# EAGLE board All-in-one Starter Kit for ESP32 P4_V1.0 (EAGLE 9.6.2), part 1 of 3
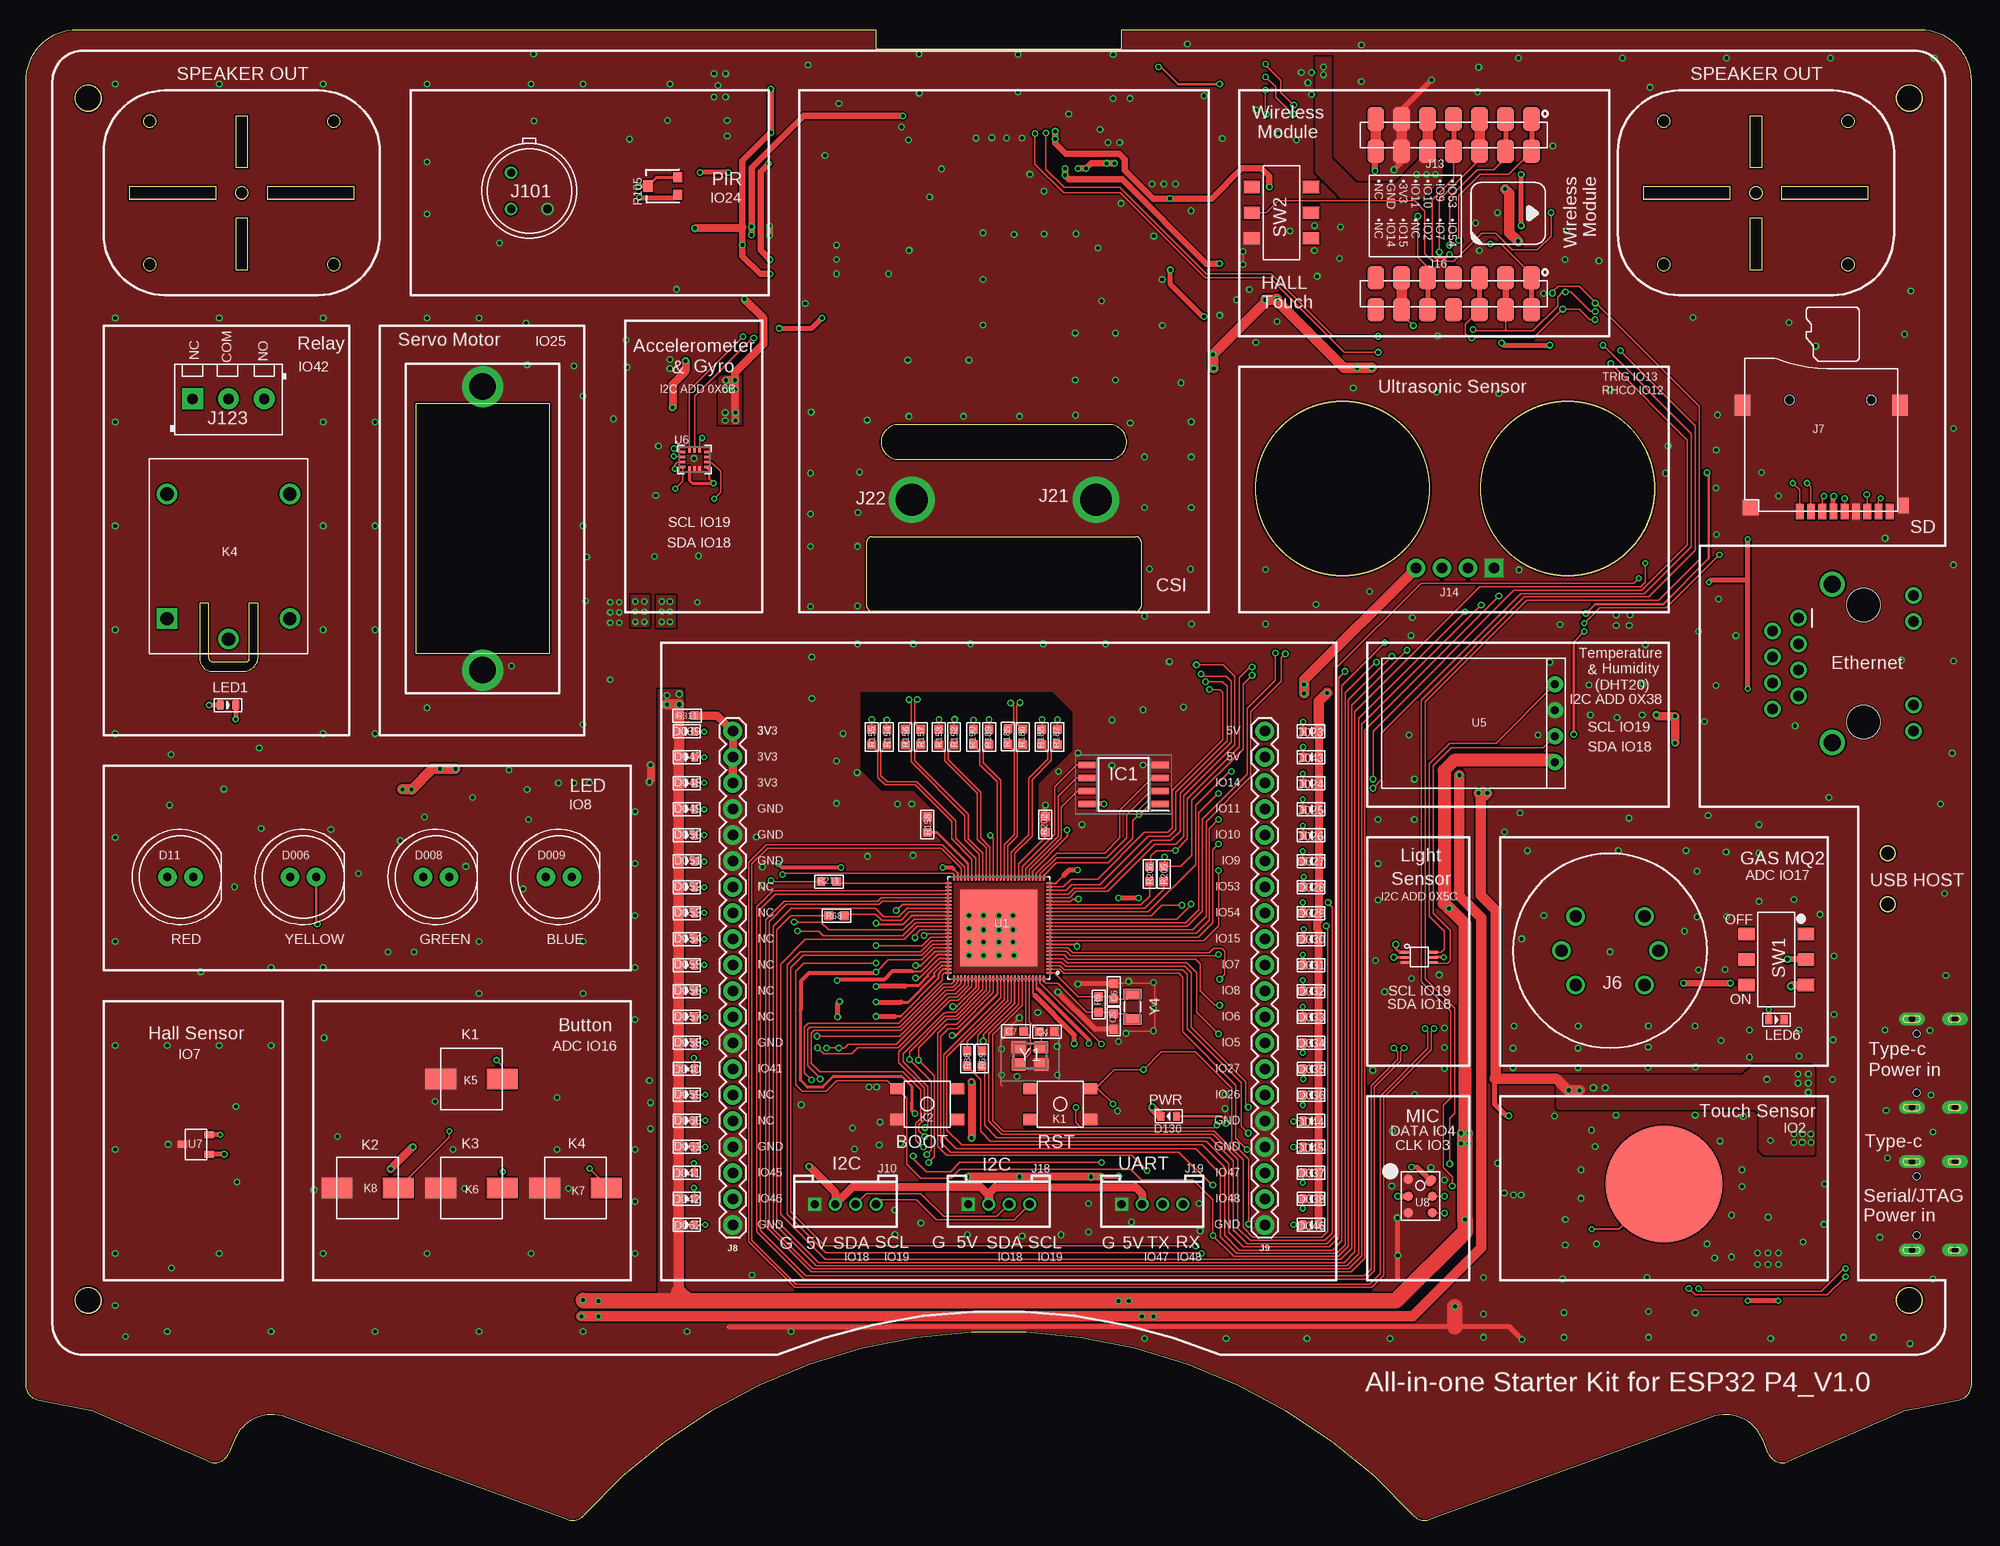
[diagram p9: board, top side]
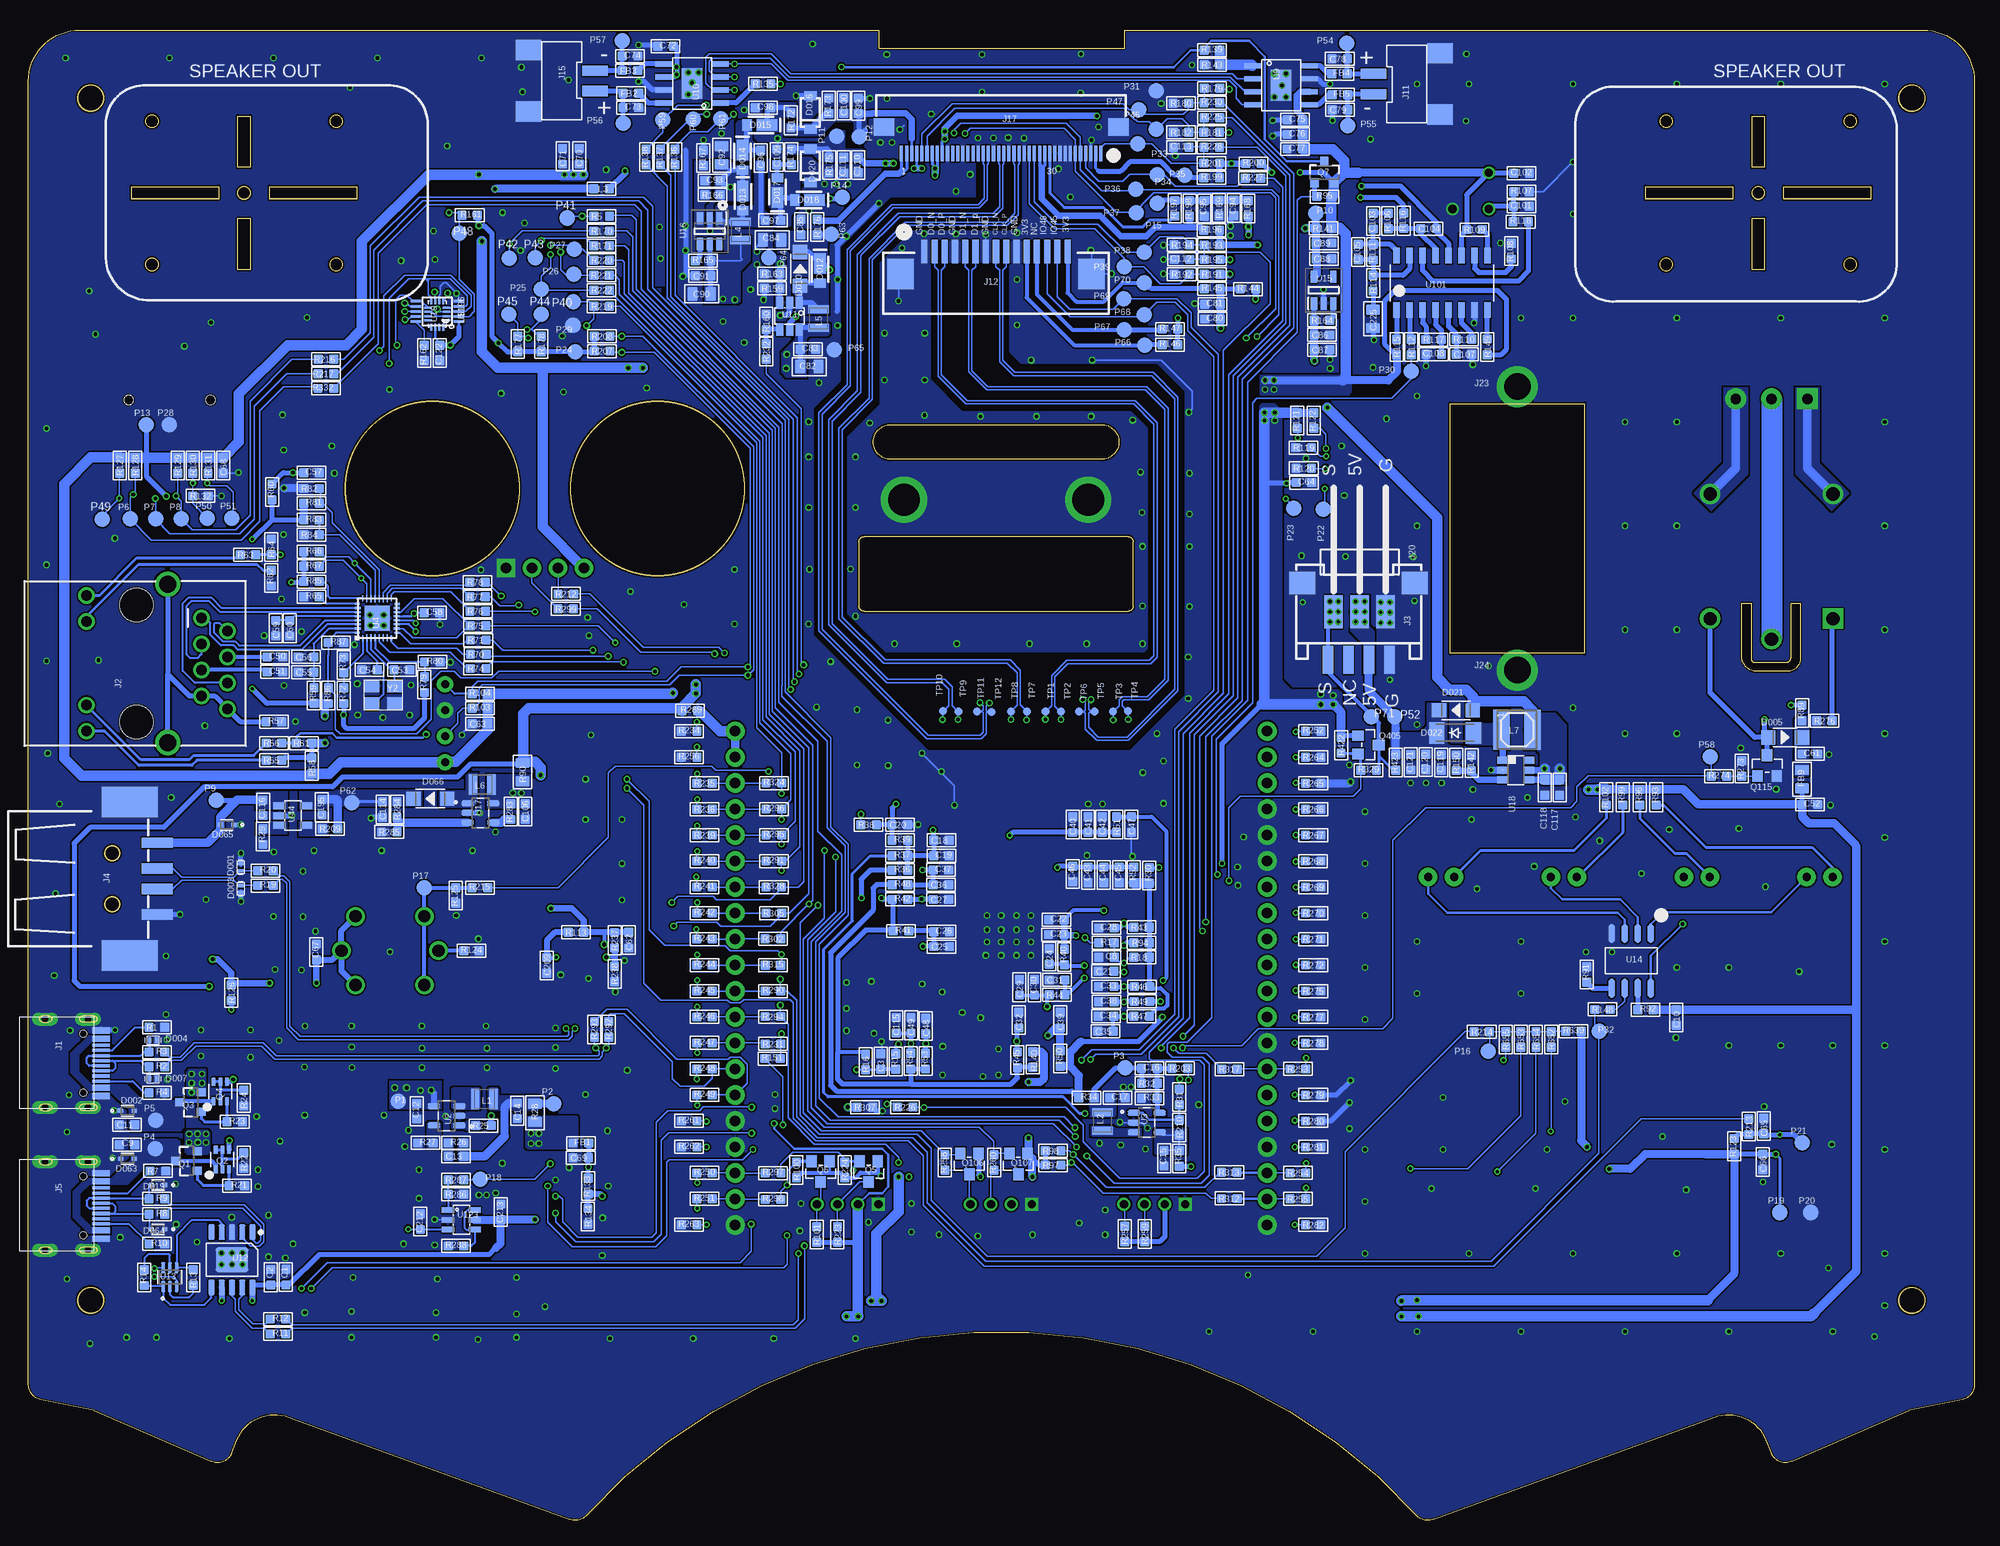
[diagram p10: board, bottom side, seen from below]

Size 190.2 x 145.66 mm. Coordinates in mm from the lower left corner, seen from the top.
Outline: 10.13,130.36 10.13,129.16 18.63,129.16 18.63,130.36 10.13,130.36
Outline: 20.53,137.26 20.53,132.26 21.73,132.26 21.73,137.26 20.53,137.26
Outline: 20.53,127.26 20.53,122.26 21.73,122.26 21.73,127.26 20.53,127.26
Outline: 23.63,130.36 23.63,129.16 32.13,129.16 32.13,130.36 23.63,130.36
Outline: 38.13,109.15 38.13,84.75 51.23,84.75 51.23,109.15 38.13,109.15
Outline: 158.13,130.36 158.13,129.16 166.63,129.16 166.63,130.36 158.13,130.36
Outline: 168.53,122.26 169.73,122.26 169.73,127.26 168.53,127.26 168.53,122.26
Outline: 168.53,137.26 168.53,132.26 169.73,132.26 169.73,137.26 168.53,137.26
Outline: 171.63,129.16 180.13,129.16 180.13,130.36 171.63,130.36 171.63,129.16
Outline: 17.04,89.63 17.04,84.39 arc90 18.11,82.99 21.41,82.99 arc90 22.75,84.67 22.75,89.64 21.82,89.64 21.82,84.36 arc-90 21.51,83.85 18.41,83.85 arc-90 17.93,84.33 17.93,89.63 17.04,89.63
Outline: 180.13,129.15 180.13,130.35 171.63,130.35 171.63,129.15 180.13,129.15
Outline: 169.73,122.25 169.73,127.25 168.53,127.25 168.53,122.25 169.73,122.25
Outline: 169.73,132.25 169.73,137.25 168.53,137.25 168.53,132.25 169.73,132.25
Outline: 166.63,129.15 166.63,130.35 158.13,130.35 158.13,129.15 166.63,129.15
Outline: 108.53,88.85 82.73,88.85 arc-90 82.23,89.35 82.23,95.65 arc-90 82.73,96.15 108.53,96.15 arc-90 109.03,95.65 109.03,89.35 arc-90 108.53,88.85
Outline: 20.53,122.25 21.73,122.25 21.73,127.25 20.53,127.25 20.53,122.25
Outline: 23.63,129.15 32.13,129.15 32.13,130.35 23.63,130.35 23.63,129.15
Outline: 10.13,129.15 18.63,129.15 18.63,130.35 10.13,130.35 10.13,129.15
Outline: 20.53,132.25 21.73,132.25 21.73,137.25 20.53,137.25 20.53,132.25
Outline: 85.33,103.7 105.93,103.7 arc180 105.93,107.1 85.33,107.1 arc180 85.33,103.7
Outline: 17.87,5.76 6.37,10.77 arc-1 1.2,11.79 arc-78 0,13.26 0,140.66 arc-90 5,145.66 83.1,145.66 83.1,143.86 107.1,143.86 107.1,145.66 185.2,145.66 arc-90 190.2,140.66 190.2,13.26 arc-78 189,11.79 arc-1 183.83,10.77 172.33,5.76 arc-92 170.34,6.57 169.83,7.84 arc88 164.75,10.1 137.28,0.09 arc-68 135.66,0.49 arc96 54.54,0.49 arc-68 52.92,0.09 25.45,10.1 arc88 20.37,7.84 19.86,6.57 arc-92 17.87,5.76
Outline: circle at 12.13,122.76 radius 0.6
Outline: circle at 12.13,136.76 radius 0.6
Outline: circle at 21.13,129.76 radius 0.6
Outline: circle at 30.13,122.76 radius 0.6
Outline: circle at 30.13,136.76 radius 0.6
Outline: circle at 128.72,100.86 radius 8.5
Outline: circle at 150.73,100.86 radius 8.5
Outline: circle at 160.13,122.76 radius 0.6
Outline: circle at 169.13,129.76 radius 0.6
Outline: circle at 160.13,136.76 radius 0.6
Outline: circle at 178.13,122.76 radius 0.6
Outline: circle at 178.13,136.76 radius 0.6
Outline: circle at 6.13,21.51 radius 1.25
Outline: circle at 6.13,139.01 radius 1.25
Outline: circle at 184.13,21.51 radius 1.25
Outline: circle at 184.13,139.01 radius 1.25
Outline: circle at 182.01,65.22 radius 0.7
Outline: circle at 182.01,60.22 radius 0.7
Outline: circle at 150.73,100.85 radius 8.5
Outline: circle at 128.72,100.85 radius 8.5
Copper layers (1*16): Top 0.035mm / dielectric 1.5mm / Bottom 0.035mm
Design rules "HMI_GZ *": minimum track width 6mil, minimum drill 0.3mm, track to track 6mil, track to pad 6mil, pad to pad 6mil, via to via 6mil, smd to smd 0mil, copper to edge 6mil, drill to drill 4mil, minimum pad ring 6mil, minimum via ring 6mil, stop-mask expansion 4mil, vias tented up to drill 100mil, thermal gap 0mil
Net classes: 1 power: width 1 mm, drill 0.3 mm, clearance 0.152 mm

## Footprints (pad centres in the part's own frame; a part is rotated, then mirrored left to right if it is on the bottom)
0603 = smd 0.889 x 0.889: 1 -0.762,0; 2 0.762,0
C0603 = smd 0.889 x 0.889: 1 -0.762,0; 2 0.762,0
C0805 = smd 1.016 x 1.397: 1 -0.889,0; 2 0.889,0
H5VL10B = smd 0.3 x 0.6: 1 -0.325,0; 2 0.325,0
TVS_LESD5D5.0CT1G = smd 0.48 x 0.4: 1 -0.66,0; 2 0.66,0
D_SOD123 = smd 1.397 x 1.397: + -1.651,0; - 1.651,0
LED-8MM = drill 0.8 pad 1.8: 1 -1.27,0; 2 1.27,0
D_SOD123FL = smd 1.397 x 1.397: + -1.651,0; - 1.651,0
LMBR140ET1G = smd 2 x 1.1: 1 -0.975,0 | smd 0.9 x 1.1: 2 0.975,0
LMSZ5233BT1G = smd 0.91 x 1.22: 1 -1.635,0; 2 1.635,0
SOD-123_MINI-SMA = smd 1.5 x 2.1: A 1.8,0; C -1.8,0
LED_0603_SMT = smd 0.762 x 0.889: 1 -0.762,0; 2 0.762,0
L0603 = smd 0.889 x 0.889: 1 -0.762,0; 2 0.762,0
L0805 = smd 1.016 x 1.397: 1 -0.889,0; 2 0.889,0
SOIC127P790X216-8N = smd 1.65 x 0.65: 1 -3.6,1.905; 2 -3.6,0.635; 3 -3.6,-0.635; 4 -3.6,-1.905; 5 3.6,-1.905; 6 3.6,-0.635; 7 3.6,0.635; 8 3.6,1.905
WZ3532R024-ESP32-V0.1-20221226_KEVIN_3.0TYPEC-SMD = smd 0.3 x 1.7: A1 -3.35,0.5; A4 -2.55,0.5; A5 -1.25,0.5; A6 -0.25,0.5; A7 0.25,0.5; A8 1.25,0.5; A9 2.55,0.5; A12 3.35,0.5; B1 3.05,0.5; B4 2.25,0.5; B5 1.75,0.5; B6 0.75,0.5; B7 -0.75,0.5; B8 -1.75,0.5; B9 -2.25,0.5; B12 -3.05,0.5 | drill 0.6 pad 1.27 long: P$9 -4.318,-0.762; P$10 4.318,-0.762; P$11 -4.318,-4.953; P$12 4.318,-4.953 | hole 0.68: -2.89,-1.22; 2.89,-1.22
LORA_BASIC_GATEWAY_-MODULE_HR911105A-RJ45 = drill 1 pad 1.6: 1 4.445,-7.285; 2 3.175,-9.825; 3 1.905,-7.285; 4 0.635,-9.825; 5 -0.635,-7.285; 6 -1.905,-9.825; 7 -3.175,-7.285; 8 -4.445,-9.825 | drill 1.02 pad 1.6: 9 6.625,3.965; 10 4.085,3.965; 11 -4.085,3.965; 12 -6.625,3.965 | drill 1.65 pad 2.184: M1 7.745,-3.985; M2 -7.745,-3.985 | hole 3.25: 5.715,-0.935; -5.715,-0.935
A_XBJ_CONNECTOR_4P-SMD-2.0-90D = smd 1.01 x 2.74: 1 -3,-0.1; 2 -1,-0.1; 3 1,-0.1; 4 3,-0.1 | smd 2.54 x 2.184: SS1 -5.5,7.4; SS2 5.5,7.4
C42605/USB2.0 = smd 1 x 3: 1 3.5,1.35; 2 1,1.35; 3 -1,1.35; 4 -3.5,1.35 | smd 3 x 5.5: 5 -7.5,-1.35; 6 7.5,-1.35
MQ2 = drill 1.2 pad 1.8: 1 0,-6.718; 2 -1.391,-3.359; 3 0,0; 4 6.718,0; 5 8.109,-3.359; 6 6.718,-6.718
9P-SMD-W/-RING = smd 1.524 x 0.762: 1 0,4.4; 2 0,3.3; 3 0,2.2; 4 0,1.1; 5 0,0; 6 0,-1.1; 7 0,-2.2; 8 0,-3.3; 9 0,-4.4 | smd 1.524 x 1.016: G1 0.6,-5.746 | smd 2.032 x 1.524: G2 10.373,-5.4; G3 10.373,10 | smd 1.524 x 1.524: G4 0.392,9.181 | hole 0.889: 10.9,-2.6; 10.9,5.4
1X20 = drill 1.016 pad 1.88: 1 0,0; 2 2.54,0; 3 5.08,0; 4 7.62,0; 5 10.16,0; 6 12.7,0; 7 15.24,0; 8 17.78,0; 9 20.32,0; 10 22.86,0; 11 25.4,0; 12 27.94,0; 13 30.48,0; 14 33.02,0; 15 35.56,0; 16 38.1,0; 17 40.64,0; 18 43.18,0; 19 45.72,0; 20 48.26,0
2.0_1X4 = drill 0.8 pad 1.27 square: 1 -3,0 | drill 0.8 pad 1.27: 2 -1,0; 3 1,0; 4 3,0
1X02L = smd 1 x 2.5: 1 0,0; 2 2,0 | smd 2 x 2.5: 3 -2,-6.5; 4 4,-6.5
C262349_15P_1MM_下接_AFA07-S15FCC-00 = smd 0.6 x 2.3: 1 -7,1.084; 2 -6,1.084; 3 -5,1.084; 4 -4,1.084; 5 -3,1.084; 6 -2,1.084; 7 -1,1.084; 8 0,1.084; 9 1,1.084; 10 2,1.084; 11 3,1.084; 12 4,1.084; 13 5,1.084; 14 6,1.084; 15 7,1.084 | smd 2.6 x 3: 16 -9.352,-1.085; 17 9.352,-1.085
H7-2.54-18.28X2.5X5MM = smd 1.65 x 2.3: 1 -7.62,-1.58; 1-1 -7.62,1.58; 2 -5.08,-1.58; 2-2 -5.08,1.58; 3 -2.54,-1.58; 3-3 -2.54,1.58; 4 0,-1.58; 4-4 0,1.58; 5 2.54,-1.58; 5-5 2.54,1.58; 6 5.08,-1.58; 6-6 5.08,1.58; 7 7.62,-1.58; 7-7 7.62,1.58
CROWPI_POW_ULTRA = drill 1 pad 1.778 square: P$1 3.81,0 | drill 1 pad 1.778: P$2 1.27,0; P$3 -1.27,0; P$4 -3.81,0
C19273935_40P_0.5MM_下接_HC-FPC-0.5-40P-FH20 = smd 0.3 x 1.5: 1 -9.75,1.3; 2 -9.25,1.3; 3 -8.75,1.3; 4 -8.25,1.3; 5 -7.75,1.3; 6 -7.25,1.3; 7 -6.75,1.3; 8 -6.25,1.3; 9 -5.75,1.3; 10 -5.25,1.3; 11 -4.75,1.3; 12 -4.25,1.3; 13 -3.75,1.3; 14 -3.25,1.3; 15 -2.75,1.3; 16 -2.25,1.3; 17 -1.75,1.3; 18 -1.25,1.3; 19 -0.75,1.3; 20 -0.25,1.3; 21 0.25,1.3; 22 0.75,1.3; 23 1.25,1.3; 24 1.75,1.3; 25 2.25,1.3; 26 2.75,1.3; 27 3.25,1.3; 28 3.75,1.3; 29 4.25,1.3; 30 4.75,1.3; 31 5.25,1.3; 32 5.75,1.3; 33 6.25,1.3; 34 6.75,1.3; 35 7.25,1.3; 36 7.75,1.3; 37 8.25,1.3; 38 8.75,1.3; 39 9.25,1.3; 40 9.75,1.3 | smd 2 x 1.7: 41 11.45,-1.3; 42 -11.45,-1.3
CON-PZ-2.54MM-1*3P-WT = smd 1.8 x 3.2: 1 -2.54,0; 2 0,0; 3 2.54,0
1X01_2MM = drill 3.1 pad 4.5: 1 0,0
1X01_2.6MM = drill 2.6 pad 4: 1 0,0
3P-D8.1MM = drill 0.8: 1 1.778,1.778; 2 -1.778,1.778; 3 -1.778,-1.778
3.5MM*3P = drill 1.016 pad 2.032 square: 1 -3.5,0 | drill 1.016 pad 2.032: 2 0,0; 3 3.5,0
KEY-4.5X4.5-SMD = smd 1.35 x 1.1: 1 -2.925,1.5; 2 -2.925,-1.5; 3 2.925,-1.5; 4 2.925,1.5
REY5-6-19.1X15.5X15.3MM = drill 1.3 pad 2 square: 1 -6.1,6 | drill 1.3 pad 2: 2 -8.1,0; 3 -6.1,-6; 4 6.1,6; 5 6.1,-6
BUTTON_2P = smd 3 x 2: P$1 0,0; P$2 6,0
1008(2520) = smd 0.8 x 2: 1 -0.9,0; 2 0.9,0
SMD-4X4MM = smd 3.9 x 1.6: 1 0,1.5; 2 0,-1.5
DISCRETE_LED-0603 = smd 0.762 x 0.889: + -0.762,0; - 0.762,0
TEST_PAD-1.5MM = smd 1.5 x 1.5: P$1 0,0
1P-D450 = smd 11.43 x 11.43: 1 0,0
SOT23-3 = smd 0.9 x 0.8: 1 1,-0.95; 2 1,0.95; 3 -1.1,0
LMBT3906DW1T1G = smd 0.78 x 0.35: 1 -0.95,0.65; 2 -0.95,0; 3 -0.95,-0.65; 4 0.95,-0.65; 5 0.95,0; 6 0.95,0.65
SOT23 = smd 1.016 x 1.143: 1 -0.889,-1.016; 2 0.889,-1.016; 3 0,1.016
SOT23@1 = smd 1.016 x 1.143: 1 -0.95,-1.016; 2 0.95,-1.016; 3 0,1.016
R0603 = smd 0.889 x 0.889: 1 -0.762,0; 2 0.762,0
R0805-SP = smd 1.016 x 1.397: 1 -0.889,0; 2 0.889,0
R0603-SP = smd 0.889 x 0.889: 1 -0.762,0; 2 0.762,0
3P-SMD-SQUA-3.6X3.3 = smd 1 x 0.9: 1 -0.85,-1.45; 3 0.85,-1.45 | smd 1.1 x 0.9: 2 0,1.45
SWITCH_6PIN_2P = smd 1.2 x 1.6: 1 2.5,-2.9; 2 0,-2.9; 3 -2.5,-2.9; 4 -2.5,2.9; 5 0,2.9; 6 2.5,2.9
TP08R = smd 0.8 x 0.8: TP 0,0
IC_ESP32-P4NRW32 = smd 0.65 x 0.18: 1 -4.925,4.375; 2 -4.925,4.025; 3 -4.925,3.675; 4 -4.925,3.325; 5 -4.925,2.975; 6 -4.925,2.625; 7 -4.925,2.275; 8 -4.925,1.925; 9 -4.925,1.575; 10 -4.925,1.225; 11 -4.925,0.875; 12 -4.925,0.525; 13 -4.925,0.175; 14 -4.925,-0.175; 15 -4.925,-0.525; 16 -4.925,-0.875; 17 -4.925,-1.225; 18 -4.925,-1.575; 19 -4.925,-1.925; 20 -4.925,-2.275; 21 -4.925,-2.625; 22 -4.925,-2.975; 23 -4.925,-3.325; 24 -4.925,-3.675; 25 -4.925,-4.025; 26 -4.925,-4.375; 53 4.925,-4.375; 54 4.925,-4.025; 55 4.925,-3.675; 56 4.925,-3.325; 57 4.925,-2.975; 58 4.925,-2.625; 59 4.925,-2.275; 60 4.925,-1.925; 61 4.925,-1.575; 62 4.925,-1.225; 63 4.925,-0.875; 64 4.925,-0.525; 65 4.925,-0.175; 66 4.925,0.175; 67 4.925,0.525; 68 4.925,0.875; 69 4.925,1.225; 70 4.925,1.575; 71 4.925,1.925; 72 4.925,2.275; 73 4.925,2.625; 74 4.925,2.975; 75 4.925,3.325; 76 4.925,3.675; 77 4.925,4.025; 78 4.925,4.375 | smd 0.18 x 0.65: 27 -4.375,-4.925; 28 -4.025,-4.925; 29 -3.675,-4.925; 30 -3.325,-4.925; 31 -2.975,-4.925; 32 -2.625,-4.925; 33 -2.275,-4.925; 34 -1.925,-4.925; 35 -1.575,-4.925; 36 -1.225,-4.925; 37 -0.875,-4.925; 38 -0.525,-4.925; 39 -0.175,-4.925; 40 0.175,-4.925; 41 0.525,-4.925; 42 0.875,-4.925; 43 1.225,-4.925; 44 1.575,-4.925; 45 1.925,-4.925; 46 2.275,-4.925; 47 2.625,-4.925; 48 2.975,-4.925; 49 3.325,-4.925; 50 3.675,-4.925; 51 4.025,-4.925; 52 4.375,-4.925; 79 4.375,4.925; 80 4.025,4.925; 81 3.675,4.925; 82 3.325,4.925; 83 2.975,4.925; 84 2.625,4.925; 85 2.275,4.925; 86 1.925,4.925; 87 1.575,4.925; 88 1.225,4.925; 89 0.875,4.925; 90 0.525,4.925; 91 0.175,4.925; 92 -0.175,4.925; 93 -0.525,4.925; 94 -0.875,4.925; 95 -1.225,4.925; 96 -1.575,4.925; 97 -1.925,4.925; 98 -2.275,4.925; 99 -2.625,4.925; 100 -2.975,4.925; 101 -3.325,4.925; 102 -3.675,4.925; 103 -4.025,4.925; 104 -4.375,4.925 | smd 7.5 x 7.5: 105 0,0
SOT95P280X145-5N = smd 1.21 x 0.59: 1 -1.255,0.95; 2 -1.255,0; 3 -1.255,-0.95; 4 1.255,-0.95; 5 1.255,0.95
QFN32_4X4 = smd 0.6 x 0.22: 1 -2.83,1.25; 8 -2.85,-1.54; 17 1.04,-1.55; 24 1.04,1.25 | smd 0.7 x 0.22: 2 -2.79,0.85; 3 -2.79,0.45; 4 -2.79,0.05; 5 -2.79,-0.35; 6 -2.79,-0.75; 7 -2.79,-1.15; 18 1,-1.15; 19 1,-0.75; 20 1,-0.35; 21 1,0.05; 22 1,0.45; 23 1,0.85 | smd 0.22 x 0.6: 9 -2.31,-2.1; 16 0.5,-2.1; 25 0.51,1.8; 32 -2.3,1.8 | smd 0.22 x 0.7: 10 -1.9,-2.05; 11 -1.5,-2.05; 12 -1.1,-2.05; 13 -0.7,-2.05; 14 -0.3,-2.05; 15 0.1,-2.05; 26 0.1,1.75; 27 -0.3,1.75; 28 -0.7,1.75; 29 -1.1,1.75; 30 -1.5,1.75; 31 -1.9,1.75 | smd 2.45 x 2.45: EXP -0.9,-0.15
CROWTAIL-DHT20-V1.0-20211013_DHT20 = drill 0.8 pad 1.6: 1 -3.81,0; 2 -1.27,0; 3 1.27,0; 4 3.81,0
LGA-14L = smd 0.475 x 0.25: 1 -1.163,0.75; 2 -1.163,0.25; 3 -1.163,-0.25; 4 -1.163,-0.75; 8 1.163,-0.75; 9 1.163,-0.25; 10 1.163,0.25; 11 1.163,0.75 | smd 0.25 x 0.475: 5 -0.5,-0.912; 6 0,-0.912; 7 0.5,-0.912; 12 0.5,0.912; 13 0,0.912; 14 -0.5,0.912
SOT-23W = smd 0.7 x 0.9: 1 -0.95,-1.3; 2 0.95,-1.3; 3 0,1.3
MIC_LMD4737T261 = smd 0.91 x 0.91: 1 -1.17,1.65; 2 -1.17,0; 3 -1.17,-1.65; 4 1.17,-1.65; 5 1.17,0 | smd 1.19 x 0.91 rotated 45: 6 1.03,1.51
NS4168-ESOP-8 = smd 1.6 x 0.5: 1 -2.8,1.905; 2 -2.8,0.635; 3 -2.8,-0.635; 4 -2.8,-1.905; 5 2.8,-1.905; 6 2.8,-0.635; 7 2.8,0.635; 8 2.8,1.905 | smd 2 x 3: 9 0,0
COOPER_SOT23-6 = smd 0.69 x 1.2: 1 -0.95,-1.3; 2 0,-1.3; 3 0.95,-1.3; 4 0.95,1.3; 5 0,1.3; 6 -0.95,1.3
ESOP-10-EP-150MIL = smd 1.5 x 0.6: 1 -2.7,2; 2 -2.7,1; 3 -2.7,0; 4 -2.7,-1; 5 -2.7,-2; 6 2.7,-2; 7 2.7,-1; 8 2.7,0; 9 2.7,1; 10 2.7,2 | smd 2.4 x 3.2: EP 0,0
SOP65P210X100-6N = smd 1.09 x 0.4: 1 -0.92,0.65; 2 -0.92,0; 3 -0.92,-0.65; 4 0.92,-0.65; 5 0.92,0; 6 0.92,0.65
WS2814A = smd 1.865 x 0.63: 1 -2.682,1.905; 2 -2.682,0.635; 3 -2.682,-0.635; 4 -2.682,-1.905; 5 2.682,-1.905; 6 2.682,-0.635; 7 2.682,0.635; 8 2.682,1.905
SOT95P282X145-5N = smd 1.2 x 0.6: 1 -1.3,0.95; 2 -1.3,0; 3 -1.3,-0.95; 4 1.3,-0.95; 5 1.3,0.95
SOT95P280X145-6N = smd 1.2 x 0.6: 1 -1.25,0.95; 2 -1.25,0; 3 -1.25,-0.95; 4 1.25,-0.95; 5 1.25,0; 6 1.25,0.95
DBV_R-PDSO-G6 = smd 0.69 x 0.99: 1 -0.95,-1.29; 2 0,-1.29; 3 0.95,-1.29; 4 0.95,1.3; 5 0,1.3; 6 -0.95,1.3
IC_SGM3799_TQFN2.6X1.8_16L = smd 0.2 x 0.7: 1 -0.6,-0.9; 2 -0.2,-0.9; 3 0.2,-0.9; 4 0.6,-0.9; 9 0.6,0.9; 10 0.2,0.9; 11 -0.2,0.9; 12 -0.6,0.9 | smd 0.7 x 0.2: 5 1.3,-0.6; 6 1.3,-0.2; 7 1.3,0.2; 8 1.3,0.6; 13 -1.3,0.6; 14 -1.3,0.2; 15 -1.3,-0.2; 16 -1.3,-0.6
IC_SOT23-5 = smd 0.69 x 1.2: 1 -0.95,-1.3; 2 0,-1.3; 3 0.95,-1.3; 4 0.95,1.3; 5 -0.95,1.3
SOP16 = smd 0.635 x 1.524: 1 0,0; 2 1.27,0; 3 2.54,0; 4 3.81,0; 5 5.08,0; 6 6.35,0; 7 7.62,0; 8 8.89,0; 9 8.89,5.334; 10 7.62,5.334; 11 6.35,5.334; 12 5.08,5.334; 13 3.81,5.334; 14 2.54,5.334; 15 1.27,5.334; 16 0,5.334
B1750 = smd 0.8 x 0.27: 1 0,0; 2 0,-0.5; 3 0,-1; 4 2.8,-1; 5 2.8,-0.5; 6 2.8,0
SOT23-6L = smd 0.55 x 1.2: 1 -0.95,-1.3; 2 0,-1.3; 3 0.95,-1.3; 4 0.95,1.3; 5 0,1.3; 6 -0.95,1.3
MSOP10 = smd 0.25 x 1: 1 -1,-2.113; 2 -0.5,-2.113; 3 0,-2.113; 4 0.5,-2.113; 5 1,-2.113; 6 1,2.113; 7 0.5,2.113; 8 0,2.113; 9 -0.5,2.113; 10 -1,2.113
X322540MPB4SI = smd 1.4 x 1.2: 1 -1.1,-0.85; 2 1.1,-0.85; 3 1.1,0.85; 4 -1.1,0.85
SMD3225 = smd 1.4 x 1.2: 1 -1.1,-0.85; 2 1.1,-0.85; 3 1.1,0.85; 4 -1.1,0.85
NORDIC_NRF_XTAL_3215_N = smd 1 x 1.8: 1 -1.25,0; 2 1.25,0

## Placement (x,y rotation side)
C1  100nF  [0603]  165.04,23.77 90 bottom
C2  100nF  [0603]  166.52,23.76 270 bottom
C3  100nF  [0603]  106.91,44.86 90 bottom
C4  15pF  [0603]  99.83,47.77 0 top
C5  12pF  [0603]  106.37,48.75 270 top
C6  12pF  [0603]  106.37,51.72 90 top
C7  15pF  [0603]  96.8,47.81 0 top
C8  100nF_NC  [0603]  84.84,55.05 180 bottom
C9  1uF  [0603]  180.57,36.72 0 bottom
C10  100nF  [0603]  29.14,49.15 90 bottom
C11  1uF  [0603]  180.57,38.67 0 bottom
C12  10uF  [0603]  152.26,39.99 270 bottom
C13  22pF  [0603]  148.41,35.6 0 bottom
C14  10uF  [0603]  142.4,40.04 90 bottom
C15  10uF  [0603]  79.21,35.39 270 bottom
C16  22pF  [0603]  80.65,44.19 180 bottom
C17  10uF  [0603]  83.76,41.32 180 bottom
C18  1uF  [0603]  100.97,66.48 0 bottom
C19  100nF  [0603]  100.97,64.95 180 bottom
C20  100nF  [0603]  105.03,68 0 bottom
C21  1uF  [0603]  84.87,53.66 0 bottom
C22  100nF  [0603]  89.73,58.72 180 bottom
C23  1uF  [0603]  89.74,57.25 180 bottom
C24  1uF  [0603]  90.43,55.11 90 bottom
C25  100nF  [0603]  100.94,56.09 0 bottom
C26  10uF  [0603]  100.94,57.54 180 bottom
C27  100nF  [0603]  101.02,60.68 0 bottom
C28  100nF  [0603]  84.84,57.9 180 bottom
C29  100nF  [0603]  93.34,52.11 90 bottom
C30  10uF  [0603]  91.87,52.11 270 bottom
C31  1uF  [0603]  89.67,52.82 0 bottom
C32  100nF  [0603]  93.41,48.89 90 bottom
C33  100nF  [0603]  84.85,52.18 180 bottom
C34  100nF  [0603]  84.89,49.27 180 bottom
C35  10uF  [0603]  84.93,47.79 0 bottom
C36  100nF  [0603]  101.02,62.14 0 bottom
C37  10uF  [0603]  101.02,63.57 180 bottom
C38  100nF  [0603]  84.85,50.7 180 bottom
C39  100nF  [0603]  89.35,48.89 90 bottom
C40  10nF  [0603]  88.14,68 90 bottom
C41  100nF  [0603]  86.65,68.02 90 bottom
C42  1uF  [0603]  85.26,68.01 90 bottom
C43  10nF  [0603]  86.64,63.1 270 bottom
C44  100nF  [0603]  85.12,63.1 270 bottom
C45  4.7uF  [0603]  83.59,63.1 270 bottom
C46  100nF  [0603]  88.14,63.17 270 bottom
C47  1uF  [0603]  82.39,68.02 90 bottom
C48  100nF  [0603]  102.49,48.32 90 bottom
C49  100nF  [0603]  103.94,48.39 90 bottom
C50  100nF  [0603]  166.1,84.38 180 bottom
C51  100nF  [0603]  166.1,82.93 180 bottom
C52  100nF  [0603]  16.09,69.97 180 bottom
C53  15pF  [C0603]  153.71,83.13 0 bottom
C54  15pF  [C0603]  156.87,83.13 0 bottom
C55  10uF  [0603]  163.08,82.91 0 bottom
C56  100nF  [0603]  163.09,84.39 0 bottom
C57  10uF  [0603]  162.54,102.4 180 bottom
C58  100nF  [0603]  150.75,88.7 180 bottom
C59  10uF  [0603]  166.03,87.2 90 bottom
C60  100nF  [0603]  164.67,87.2 90 bottom
C61  100nF  [0603]  16.09,74.91 180 bottom
C62  1uF  [C0603]  131.53,56.71 90 bottom
C63  100nF  [0603]  146.08,77.86 0 bottom
C64  100nF  [0603]  65.53,101.44 180 bottom
C65  1uF  [0603]  20.58,38.54 90 bottom
C66  100nF  [0603]  20.68,35.04 90 bottom
C67  100nF  [0603]  162.06,55.57 270 bottom
C68  1uF  [C0603]  171.16,103.12 90 bottom
C69  100nF  [0603]  136.22,35.45 0 bottom
C70  1uF  [0603]  136.38,133.33 90 bottom
C71  47uF  [0603]  138,133.33 90 bottom
C72  47uF  [0603]  127.92,144.07 180 bottom
C73  1nF  [0603]  131.32,138.09 180 bottom
C74  1nF  [0603]  131.39,143.12 180 bottom
C75  1uF  [0603]  66.4,136.89 180 bottom
C76  47uF  [0603]  66.41,135.46 180 bottom
C77  47uF  [0603]  66.43,134.04 180 bottom
C78  1nF  [0603]  62.04,142.85 0 bottom
C79  1nF  [0603]  62.01,137.88 0 bottom
C80  10uF  [0603]  74.48,117.43 180 bottom
C81  100nF  [0603]  74.48,118.88 180 bottom
C82  22uF  [C0805]  113.88,112.77 0 bottom
C83  1uF  [C0603]  114.02,114.48 180 bottom
C84  22uF  [C0805]  117.51,125.14 180 bottom
C85  100nF  [0603]  114.69,126.42 270 bottom
C86  10uF  [0603]  63.77,115.86 0 bottom
C87  100nF  [0603]  63.77,114.4 0 bottom
C88  10uF  [0603]  63.57,123.32 0 bottom
C89  100nF  [0603]  63.57,124.85 0 bottom
C90  22uF  [C0805]  124.4,119.88 180 bottom
C91  100nF  [0603]  124.28,121.64 180 bottom
C92  22uF  [C0805]  122.45,133.43 90 bottom
C93  10nF/25V  [0603]  123.35,130.92 180 bottom
C94  10uF  [0603]  72.39,128.27 270 bottom
C95  100nF  [0603]  75.29,128.22 270 bottom
C96  1uF  [0603]  118.64,133.15 90 bottom
C97  1uF  [0603]  117.45,127.06 0 bottom
C98  1uF  [0603]  118.39,138.08 180 bottom
C99  10uF  [0603]  109.08,138.26 90 bottom
C100  100nF  [0603]  110.53,138.29 90 bottom
C101  10nF  [C0603]  44.29,128.43 180 bottom
C102  100nF  [0603]  44.25,131.67 180 bottom
C103  10uF  [0603]  58.76,126.99 270 bottom
C104  22nF  [C0603]  53.34,126.27 0 bottom
C105  22nF  [C0603]  60.24,123.98 270 bottom
C106  10uF  [0603]  141.66,69.28 90 bottom
C107  10nF  [C0603]  49.9,113.97 0 bottom
C108  10nF  [C0603]  52.85,113.96 180 bottom
C109  1uF  [0603]  117.07,133.28 90 bottom
C110  10uF  [0603]  109.1,132.47 270 bottom
C111  100nF  [0603]  110.53,132.46 270 bottom
C112  1uF_NC  [0603]  77.46,123.25 180 bottom
C113  1uF  [0603]  77.53,134.22 180 bottom
C114  10uF  [0603]  155.6,69.47 90 bottom
C115  10uF  [0603]  105.37,48.4 90 bottom
C116  10uF  [0603]  167.28,69.65 270 bottom
C117  10uF  [C0603]  40.55,71.62 90 bottom
C118  100nF  [0603]  42.01,71.62 90 bottom
C119  10uF  [C0603]  52.11,74.08 90 bottom
C120  10uF  [C0603]  53.63,74.13 90 bottom
C121  100nF  [0603]  55.09,74.1 90 bottom
C122  1uF  [0603]  149.99,114.1 90 bottom
C195  4.7uF  [0603]  161.52,69.7 270 bottom
C209  100nF  [0603]  139.54,54.25 90 bottom
C212  12pF  [C0603]  151.89,29.2 270 bottom
C213  4.7uF  [0603]  144.02,30.15 270 bottom
C225  47uF  [C0805]  58.78,117.44 90 bottom
D001  NC/H5VL10B  [H5VL10B]  169.45,63.84 270 bottom
D002  LESD5D5.0CT1G  [TVS_LESD5D5.0CT1G]  180.52,40.04 0 bottom
D003  NC/H5VL10B  [H5VL10B]  169.45,61.73 90 bottom
D004  H5VL10B  [H5VL10B]  178.02,46.94 0 bottom
D005  1N4148  [D_SOD123]  18.51,76.52 0 bottom
D006  YELLOW  [LED-8MM]  27.13,62.89 0 top
D007  H5VL10B  [H5VL10B]  178.02,43.17 0 bottom
D008  GREEN  [LED-8MM]  40.13,62.89 0 top
D009  BLUE  [LED-8MM]  52.13,62.89 0 top
D010  DSS34_NC  [D_SOD123FL]  114.79,122.33 90 bottom
D11  RED  [LED-8MM]  15.13,62.89 0 top
D012  LMBR140ET1G  [LMBR140ET1G]  112.84,121.89 270 bottom
D013  LMBR140ET1G  [LMBR140ET1G]  120.38,128.98 270 bottom
D014  LMBR140ET1G  [LMBR140ET1G]  120.4,132.95 270 bottom
D015  LMBR140ET1G  [LMBR140ET1G]  119,136.38 180 bottom
D016  MM1W18_18V  [LMSZ5233BT1G]  113.78,137.61 90 bottom
D017  LMBR140ET1G  [LMBR140ET1G]  117,130.26 90 bottom
D018  LMBR140ET1G  [LMBR140ET1G]  114.33,129.05 180 bottom
D019  LESD5D5.0CT1G  [TVS_LESD5D5.0CT1G]  177.54,32.78 180 bottom
D020  LMSZ5233BT1G_-6V  [LMSZ5233BT1G]  113.77,132.41 90 bottom
D021  DSS34_NC  [D_SOD123FL]  50.68,79.18 180 bottom
D022  B5819W  [SOD-123_MINI-SMA]  50.76,76.97 0 bottom
D023  GREEN  [LED_0603_SMT]  125.63,77.14 180 top
D024  GREEN  [LED_0603_SMT]  125.63,72.06 180 top
D025  GREEN  [LED_0603_SMT]  125.63,69.52 180 top
D026  GREEN  [LED_0603_SMT]  125.63,66.98 180 top
D027  GREEN  [LED_0603_SMT]  125.63,64.44 180 top
D028  GREEN  [LED_0603_SMT]  125.63,61.9 180 top
D029  GREEN  [LED_0603_SMT]  125.63,59.36 180 top
D030  GREEN  [LED_0603_SMT]  125.63,56.82 180 top
D031  GREEN  [LED_0603_SMT]  125.63,54.28 180 top
D032  GREEN  [LED_0603_SMT]  125.63,51.74 180 top
D033  GREEN  [LED_0603_SMT]  125.63,49.2 180 top
D034  GREEN  [LED_0603_SMT]  125.63,46.66 180 top
D035  GREEN  [LED_0603_SMT]  125.63,44.12 180 top
D036  GREEN  [LED_0603_SMT]  125.63,41.58 180 top
D037  GREEN  [LED_0603_SMT]  125.63,33.96 180 top
D038  GREEN  [LED_0603_SMT]  125.63,31.42 180 top
D039  GREEN  [LED_0603_SMT]  64.63,77.14 0 top
D040  GREEN  [LED_0603_SMT]  64.63,44.12 0 top
D041  GREEN  [LED_0603_SMT]  64.63,33.96 0 top
D042  GREEN  [LED_0603_SMT]  64.63,31.42 0 top
D043  GREEN  [LED_0603_SMT]  125.63,74.6 180 top
D044  GREEN  [LED_0603_SMT]  125.63,39.04 180 top
D045  GREEN  [LED_0603_SMT]  125.63,36.5 180 top
D046  GREEN  [LED_0603_SMT]  125.63,28.88 180 top
D047  GREEN  [LED_0603_SMT]  64.63,74.6 0 top
D048  GREEN  [LED_0603_SMT]  64.63,72.06 0 top
D049  GREEN  [LED_0603_SMT]  64.63,69.52 0 top
D050  GREEN  [LED_0603_SMT]  64.63,66.98 0 top
D051  GREEN  [LED_0603_SMT]  64.64,64.44 0 top
D052  GREEN  [LED_0603_SMT]  64.63,61.9 0 top
D053  GREEN  [LED_0603_SMT]  64.63,59.36 0 top
D054  GREEN  [LED_0603_SMT]  64.63,56.82 0 top
D055  GREEN  [LED_0603_SMT]  64.63,54.28 0 top
D056  GREEN  [LED_0603_SMT]  64.63,51.74 0 top
D057  GREEN  [LED_0603_SMT]  64.63,49.2 0 top
D058  GREEN  [LED_0603_SMT]  64.63,46.66 0 top
D059  GREEN  [LED_0603_SMT]  64.63,41.58 0 top
D060  GREEN  [LED_0603_SMT]  64.63,39.04 0 top
D061  GREEN  [LED_0603_SMT]  64.63,36.5 0 top
D062  GREEN  [LED_0603_SMT]  64.63,28.88 0 top
D063  LESD5D5.0CT1G  [TVS_LESD5D5.0CT1G]  180.52,35.34 0 bottom
D064  LESD5D5.0CT1G  [TVS_LESD5D5.0CT1G]  177.54,28.44 180 bottom
D065  LESD5D5.0CT1G  [TVS_LESD5D5.0CT1G]  170.82,67.98 180 bottom
D066  DSS34  [D_SOD123FL]  150.93,70.54 180 bottom
D130  RED  [LED_0603_SMT]  111.73,39.49 180 top
FB1  0R/800mA  [L0603]  136.21,36.88 0 bottom
FB2  1K/磁珠  [L0603]  131.33,139.5 180 bottom
FB3  1K/磁珠  [L0603]  131.4,141.71 180 bottom
FB4  1K/磁珠  [L0603]  62.06,141.4 0 bottom
FB5  1K/磁珠  [L0603]  62.01,139.35 0 bottom
FB9  FB 220R/MH2012HM221-T  [L0805]  16.85,72.45 270 bottom
IC1  W25Q128JVSIQ  [SOIC127P790X216-8N]  107.32,71.94 180 top
J1  USB2 High Speed & Power in  [WZ3532R024-ESP32-V0.1-20221226_KEVIN_3.0TYPEC-SMD]  183.63,44.68 270 bottom
J2  HR913550A  [LORA_BASIC_GATEWAY_-MODULE_HR911105A-RJ45]  180.58,83.76 90 bottom
J3  [A_XBJ_CONNECTOR_4P-SMD-2.0-90D]  60.19,84.21 0 bottom
J4  C42605_USB-TypeA  [C42605/USB2.0]  178.96,62.72 270 bottom
J5  USB1 & Power in  [WZ3532R024-ESP32-V0.1-20221226_KEVIN_3.0TYPEC-SMD]  183.63,30.74 270 bottom
J6  Gas Sensor Socket  [MQ2]  158.23,52.32 180 top
J7  [9P-SMD-W/-RING]  177.81,98.61 90 top
J8  [1X20]  69.13,77.14 270 top
J9  [1X20]  121.13,77.14 270 top
J10  TWIG_2.0  [2.0_1X4]  80.13,30.89 0 top
J11  L  [1X02L]  58.73,139.4 90 bottom
J12  [C262349_15P_1MM_下接_AFA07-S15FCC-00]  95.64,122.91 0 bottom
J13  [H7-2.54-18.28X2.5X5MM]  139.59,135.39 180 top
J14  CROWPI_POW_ULTRA  [CROWPI_POW_ULTRA]  139.72,93.08 0 top
J15  R  [1X02L]  134.83,141.7 270 bottom
J16  [H7-2.54-18.28X2.5X5MM]  139.59,119.89 180 top
J17  [C19273935_40P_0.5MM_下接_HC-FPC-0.5-40P-FH20]  95.13,134.89 180 bottom
J18  TWIG_2.0  [2.0_1X4]  95.13,30.89 0 top
J19  TWIG_2.0  [2.0_1X4]  110.13,30.89 0 top
J20  CON-2.54MM-3P  [CON-PZ-2.54MM-1*3P-WT]  60.09,88.81 0 bottom
J21  [1X01_2MM]  104.63,99.75 0 top
J22  [1X01_2MM]  86.63,99.75 0 top
J23  [1X01_2.6MM]  44.68,110.81 0 bottom
J24  [1X01_2.6MM]  44.68,83.11 0 bottom
J101  D203S_C78793  [3P-D8.1MM]  49.24,129.95 90 top
J123  3.5MM3P  [3.5MM*3P]  19.83,109.62 0 top
K1  KEY-4.5X4.5  [KEY-4.5X4.5-SMD]  101.13,40.69 180 top
K2  KEY-4.5X4.5  [KEY-4.5X4.5-SMD]  88.13,40.69 0 top
K4  [REY5-6-19.1X15.5X15.3MM]  19.83,94.23 90 top
K5  BUTTON_2P  [BUTTON_2P]  40.59,43.14 0 top
K6  BUTTON_2P  [BUTTON_2P]  40.59,32.47 0 top
K7  BUTTON_2P  [BUTTON_2P]  50.75,32.47 0 top
K8  BUTTON_2P  [BUTTON_2P]  30.43,32.47 0 top
L1  2.2μH_C5832372  [1008(2520)]  145.64,41.2 0 bottom
L2  2.2μH_C5832372  [1008(2520)]  85.22,38.98 90 bottom
L3  NC  [L0603]  134.18,130.15 180 bottom
L4  4.7uH_C45385206_2.4A  [1008(2520)]  120.6,126.04 90 bottom
L5  4.7uH_C45385206_2.4A  [1008(2520)]  112.99,117.47 90 bottom
L6  4.7uH_C45385206_2.4A  [1008(2520)]  145.85,71.94 180 bottom
L7  10UH  [SMD-4X4MM]  44.71,77.27 270 bottom
LED1  RED  [DISCRETE_LED-0603]  19.79,79.69 0 top
LED6  RED  [DISCRETE_LED-0603]  171.13,48.93 0 top
P1  TEST_PADPAD-1.5MM  [TEST_PAD-1.5MM]  154.06,40.95 0 bottom
P2  TEST_PADPAD-1.5MM  [TEST_PAD-1.5MM]  138.86,40.74 0 bottom
P3  TEST_PADPAD-1.5MM  [TEST_PAD-1.5MM]  83,44.23 0 bottom
P4  TEST_PADPAD-1.5MM  [TEST_PAD-1.5MM]  177.8,36.31 0 bottom
P5  TEST_PADPAD-1.5MM  [TEST_PAD-1.5MM]  177.75,39.12 0 bottom
P6  TEST_PADPAD-1.5MM  [TEST_PAD-1.5MM]  180.28,97.88 0 bottom
P7  TEST_PADPAD-1.5MM  [TEST_PAD-1.5MM]  177.77,97.88 0 bottom
P8  TEST_PADPAD-1.5MM  [TEST_PAD-1.5MM]  175.26,97.88 0 bottom
P9  TEST_PADPAD-1.5MM  [TEST_PAD-1.5MM]  171.85,70.38 0 bottom
P10  TEST_PADPAD-1.5MM  [TEST_PAD-1.5MM]  64.39,127.77 0 bottom
P11  TEST_PADPAD-1.5MM  [TEST_PAD-1.5MM]  111.21,135.28 270 bottom
P12  TEST_PADPAD-1.5MM  [TEST_PAD-1.5MM]  109,135.24 270 bottom
P13  TEST_PADPAD-1.5MM  [TEST_PAD-1.5MM]  178.71,107.08 0 bottom
P14  TEST_PADPAD-1.5MM  [TEST_PAD-1.5MM]  110.65,129.32 0 bottom
P15  TEST_PADPAD-1.5MM  [TEST_PAD-1.5MM]  79.85,128.73 0 bottom
P16  TEST_PADPAD-1.5MM  [TEST_PAD-1.5MM]  47.5,45.84 0 bottom
P17  TEST_PADPAD-1.5MM  [TEST_PAD-1.5MM]  151.51,61.83 0 bottom
P18  TEST_PADPAD-1.5MM  [TEST_PAD-1.5MM]  146.04,33.35 0 bottom
P19  TEST_PADPAD-1.5MM  [TEST_PAD-1.5MM]  19.03,30.09 0 bottom
P20  TEST_PADPAD-1.5MM  [TEST_PAD-1.5MM]  16.02,30.09 0 bottom
P21  TEST_PADPAD-1.5MM  [TEST_PAD-1.5MM]  16.81,36.89 0 bottom
P22  TEST_PADPAD-1.5MM  [TEST_PAD-1.5MM]  63.63,98.85 0 bottom
P23  TEST_PADPAD-1.5MM  [TEST_PAD-1.5MM]  66.53,98.91 0 bottom
P24  TEST_PADPAD-1.5MM  [TEST_PAD-1.5MM]  136.75,114.22 0 bottom
P25  TEST_PADPAD-1.5MM  [TEST_PAD-1.5MM]  140.08,120.33 0 bottom
P26  TEST_PADPAD-1.5MM  [TEST_PAD-1.5MM]  136.89,121.81 0 bottom
P27  TEST_PADPAD-1.5MM  [TEST_PAD-1.5MM]  136.86,124.26 0 bottom
P28  TEST_PADPAD-1.5MM  [TEST_PAD-1.5MM]  176.44,107.09 0 bottom
P29  TEST_PADPAD-1.5MM  [TEST_PAD-1.5MM]  136.98,116.79 0 bottom
P30  TEST_PADPAD-1.5MM  [TEST_PAD-1.5MM]  55.03,112.3 0 bottom
P31  TEST_PADPAD-1.5MM  [TEST_PAD-1.5MM]  79.96,139.75 0 bottom
P32  TEST_PADPAD-1.5MM  [TEST_PAD-1.5MM]  36.66,47.81 0 bottom
P33  TEST_PADPAD-1.5MM  [TEST_PAD-1.5MM]  81.79,134.57 90 bottom
P34  TEST_PADPAD-1.5MM  [TEST_PAD-1.5MM]  77.18,131.5 90 bottom
P35  TEST_PADPAD-1.5MM  [TEST_PAD-1.5MM]  79.88,131.51 90 bottom
P36  TEST_PADPAD-1.5MM  [TEST_PAD-1.5MM]  81.97,130.12 0 bottom
P37  TEST_PADPAD-1.5MM  [TEST_PAD-1.5MM]  81.94,127.79 0 bottom
P38  TEST_PADPAD-1.5MM  [TEST_PAD-1.5MM]  81.14,123.94 90 bottom
P39  TEST_PADPAD-1.5MM  [TEST_PAD-1.5MM]  83.12,122.51 90 bottom
P40  TEST_PADPAD-1.5MM  [TEST_PAD-1.5MM]  136.94,119.1 0 bottom
P41  TEST_PADPAD-1.5MM  [TEST_PAD-1.5MM]  137.55,127.3 0 bottom
P42  TEST_PADPAD-1.5MM  [TEST_PAD-1.5MM]  143.21,123.34 0 bottom
P43  TEST_PADPAD-1.5MM  [TEST_PAD-1.5MM]  140.67,123.43 0 bottom
P44  TEST_PADPAD-1.5MM  [TEST_PAD-1.5MM]  140.09,117.91 0 bottom
P45  TEST_PADPAD-1.5MM  [TEST_PAD-1.5MM]  143.26,117.91 0 bottom
P46  TEST_PADPAD-1.5MM  [TEST_PAD-1.5MM]  79.96,135.97 0 bottom
P47  TEST_PADPAD-1.5MM  [TEST_PAD-1.5MM]  81.66,137.89 0 bottom
P48  TEST_PADPAD-1.5MM  [TEST_PAD-1.5MM]  148.09,125.79 0 bottom
P49  TEST_PADPAD-1.5MM  [TEST_PAD-1.5MM]  183.01,97.85 0 bottom
P50  TEST_PADPAD-1.5MM  [TEST_PAD-1.5MM]  172.72,97.97 0 bottom
P51  TEST_PADPAD-1.5MM  [TEST_PAD-1.5MM]  170.31,97.97 0 bottom
P52  TEST_PADPAD-1.5MM  [TEST_PAD-1.5MM]  56.65,78.54 0 bottom
P54  TEST_PADPAD-1.5MM  [TEST_PAD-1.5MM]  61.33,144.37 0 bottom
P55  TEST_PADPAD-1.5MM  [TEST_PAD-1.5MM]  61.27,136.33 0 bottom
P56  TEST_PADPAD-1.5MM  [TEST_PAD-1.5MM]  132.06,136.55 0 bottom
P57  TEST_PADPAD-1.5MM  [TEST_PAD-1.5MM]  132.15,144.6 0 bottom
P58  TEST_PADPAD-1.5MM  [TEST_PAD-1.5MM]  25.81,74.66 0 bottom
P59  TEST_PADPAD-1.5MM  [TEST_PAD-1.5MM]  128.18,136.91 0 bottom
P60  TEST_PADPAD-1.5MM  [TEST_PAD-1.5MM]  125.21,136.96 0 bottom
P61  TEST_PADPAD-1.5MM  [TEST_PAD-1.5MM]  122.55,137.01 0 bottom
P62  TEST_PADPAD-1.5MM  [TEST_PAD-1.5MM]  158.62,70.15 0 bottom
P63  TEST_PADPAD-1.5MM  [TEST_PAD-1.5MM]  111.75,125.72 270 bottom
P64  TEST_PADPAD-1.5MM  [TEST_PAD-1.5MM]  117.83,123.41 270 bottom
P65  TEST_PADPAD-1.5MM  [TEST_PAD-1.5MM]  111.43,114.43 180 bottom
P66  TEST_PADPAD-1.5MM  [TEST_PAD-1.5MM]  81.07,114.87 0 bottom
P67  TEST_PADPAD-1.5MM  [TEST_PAD-1.5MM]  83.1,116.39 0 bottom
P68  TEST_PADPAD-1.5MM  [TEST_PAD-1.5MM]  81.13,117.83 0 bottom
P69  TEST_PADPAD-1.5MM  [TEST_PAD-1.5MM]  83.14,119.4 0 bottom
P70  TEST_PADPAD-1.5MM  [TEST_PAD-1.5MM]  81.15,120.97 0 bottom
P71  TEST_PADPAD-1.5MM  [TEST_PAD-1.5MM]  58.93,78.54 0 bottom
P101  KEY  [1P-D450]  160.13,32.89 0 top
Q1  AO3401A  [SOT23-3]  174.71,35.13 0 bottom
Q2  LMBT3906DW1T1G  [LMBT3906DW1T1G]  171.25,35.28 90 bottom
Q3  AO3401A  [SOT23-3]  174.32,40.88 0 bottom
Q4  LMBT3906DW1T1G  [LMBT3906DW1T1G]  171.45,41.93 90 bottom
Q5  BSS138  [SOT23]  108.08,34.09 180 bottom
Q6  BSS138  [SOT23]  112.78,34.09 180 bottom
Q7  AO3401A  [SOT23-3]  63.56,131.73 270 bottom
Q106  BSS138  [SOT23]  98.24,34.85 180 bottom
Q107  BSS138  [SOT23]  93.44,34.85 180 bottom
Q115  S9013  [SOT23@1]  20.27,73.76 0 bottom
Q405  2N7002  [SOT23]  59.24,75.8 270 bottom
R1  5.1K  [R0603]  177.66,48.19 0 bottom
R2  0R  [R0603]  177.66,44.33 180 bottom
R3  0R  [R0603]  177.66,45.77 180 bottom
R4  5.1K  [R0603]  177.66,41.78 180 bottom
R5  0R  [R0603]  134.18,127.47 0 bottom
R6  10M_NC  [R0603]  104.87,50.42 270 top
R7  5.1K  [R0603]  177.56,34.15 0 bottom
R8  0R  [R0603]  177.66,29.92 180 bottom
R9  0R  [R0603]  177.66,31.42 180 bottom
R10  5.1K  [R0603]  177.66,27.02 180 bottom
R11  22R  [R0603]  165.8,18.22 180 bottom
R12  22R  [R0603]  165.8,19.68 180 bottom
R13  10K  [R0603]  174.11,23.73 90 bottom
R14  10K  [R0603]  178.87,23.72 270 bottom
R15  0R  [R0603]  105.44,44.86 270 bottom
R16  10K  [R0603]  108.39,44.81 90 bottom
R17  0R  [R0603]  84.84,56.44 180 bottom
R18  10K  [R0603]  81.41,55.05 0 bottom
R19  0R  [R0603]  167.04,62.05 180 bottom
R20  0R  [R0603]  167.03,63.51 180 bottom
R21  51K  [R0603]  169.84,32.7 180 bottom
R22  10K  [R0603]  169.15,35.16 90 bottom
R23  51K  [R0603]  170.04,38.95 180 bottom
R24  10K  [R0603]  169.17,41.27 90 bottom
R25  10K  [R0603]  145.74,38.59 0 bottom
R26  100K  [R0603]  148.41,36.89 180 bottom
R27  22.1K  [R0603]  151.4,36.89 180 bottom
R28  0R/0805  [R0805-SP]  140.7,39.84 270 bottom
R29  13k  [R0603]  167.29,66.83 270 bottom
R30  0R  [R0603]  80.65,63.05 270 bottom
R31  0R  [R0603]  77.73,41.39 90 bottom
R32  10K_NC  [R0603]  80.65,42.71 0 bottom
R33  10K_NC  [R0603]  80.65,41.27 180 bottom
R34  0R  [R0603]  86.8,41.31 180 bottom
R35  0R  [R0603]  77.72,35.38 270 bottom
R36  0R_NC  [R0603]  105.03,63.56 180 bottom
R37  0R  [R0603]  105.03,64.95 180 bottom
R38  10K  [R0603]  108.08,68 0 bottom
R39  0R  [R0603]  105.03,66.48 180 bottom
R40  0R  [R0603]  88.94,55.06 270 bottom
R41  0R  [R0603]  104.93,57.61 180 bottom
R42  0R  [R0603]  105.01,60.68 180 bottom
R43  0R  [R0603]  81.41,57.97 0 bottom
R44  0R  [R0603]  89.67,51.36 0 bottom
R45  0R  [R0603]  93.54,45.01 270 bottom
R46  0R  [R0603]  81.37,52.18 0 bottom
R47  0R  [R0603]  81.39,49.28 0 bottom
R48  0R  [R0603]  105.01,62.13 180 bottom
R49  0R  [R0603]  81.37,50.72 0 bottom
R50  0R  [R0603]  89.35,45.14 270 bottom
R51  0R  [R0603]  83.86,68 90 bottom
R52  0R  [R0603]  82.17,63.1 270 bottom
R53  0R  [R0603]  102.52,44.89 270 bottom
R54  0R  [R0603]  103.97,44.89 270 bottom
R55  0R  [R0603]  166.2,74.3 0 bottom
R56  1K  [R0603]  166.21,75.98 0 bottom
R57  1M  [R0603]  166.22,78.06 180 bottom
R58  0R  [R0603]  162.5,73.76 90 bottom
R59  0R  [R0603]  162.3,80.62 270 bottom
R60  0R  [R0603]  166.4,100.53 270 bottom
R61  5.1K  [R0603]  163.28,75.98 0 bottom
R62  1K  [R0603]  166.48,92.09 270 bottom
R63  0R  [R0603]  168.74,94.38 0 bottom
R64  5.1K  [R0603]  166.48,95.15 90 bottom
R65  6.2K  [R0603]  162.54,90.28 180 bottom
R66  1.5K_NC  [R0603]  162.53,94.68 180 bottom
R67  1.5K  [R0603]  162.53,93.26 180 bottom
R68  0R  [R0603]  79.25,59.11 0 top
R69  0R  [R0603]  93.48,45.14 90 top
R70  0R  [R0603]  146.23,84.65 0 bottom
R71  0R  [R0603]  146.24,86.04 0 bottom
R72  5.1K_NC  [R0603]  159.4,80.61 270 bottom
R73  5.1K  [R0603]  159.4,83.62 270 bottom
R74  0R  [R0603]  146.25,83.27 0 bottom
R75  0R  [R0603]  146.27,87.44 0 bottom
R76  0R  [R0603]  146.29,88.86 0 bottom
R77  0R  [R0603]  146.31,90.27 0 bottom
R78  0R  [R0603]  146.31,91.7 0 bottom
R79  5.1K  [R0603]  151.5,81.68 270 bottom
R80  5.1K_NC  [R0603]  150.73,83.9 180 bottom
R81  5.1K  [R0603]  162.53,99.42 180 bottom
R82  5.1K_NC  [R0603]  162.53,100.86 0 bottom
R83  5.1K  [R0603]  162.54,97.78 180 bottom
R84  5.1K_NC  [R0603]  162.53,96.34 0 bottom
R85  5.1K_NC  [R0603]  162.53,91.76 180 bottom
R86  10K_NC  [R0603]  160.88,80.61 270 bottom
R87  10K_NC  [R0603]  160.15,85.8 180 bottom
R88  0R  [R0603]  92.02,45.14 90 top
R89  4.7K  [R0603]  16.85,78.92 270 bottom
R90  0R  [R0805-SP]  141.91,73.14 90 bottom
R91  0R_NC  [R0603]  37.9,53.36 270 bottom
R92  1K  [R0603]  32.15,49.91 180 bottom
R93  470R  [R0603]  31.1,70.68 270 bottom
R94  10K  [R0603]  81.4,56.47 180 bottom
R95  10K  [R0603]  63.53,129.39 0 bottom
R96  100R  [R0603]  32.7,70.68 270 bottom
R97  4.7K  [R0603]  90.05,34.73 0 bottom
R98  4.7K  [R0603]  90.05,36.12 0 bottom
R99  470R  [R0603]  34.39,70.68 270 bottom
R100  4.7K  [R0603-SP]  115.14,34.26 90 bottom
R101  4.7K  [R0603-SP]  113.16,27.93 90 bottom
R102  470R  [R0603]  35.99,70.68 270 bottom
R103  4.7K_NC  [R0603]  146.07,79.38 180 bottom
R104  4.7K_NC  [R0603]  146.08,80.79 180 bottom
R105  500K  [3P-SMD-SQUA-3.6X3.3]  62.29,130.43 90 top
R106  1K  [R0603]  57.27,127 270 bottom
R107  10K  [R0603]  44.26,129.87 180 bottom
R108  1M  [R0603]  45.27,124.06 270 bottom
R109  10K  [R0603]  48.87,126.17 0 bottom
R110  1M  [R0603]  49.89,115.44 0 bottom
R111  1M_1%  [R0603]  58.75,123.95 270 bottom
R112  10K  [R0603]  55.05,114.7 90 bottom
R113  10K  [R0603]  136.69,57.47 0 bottom
R114  3.3K  [R0603]  58.78,120.92 90 bottom
R115  10K  [R0603]  56.48,114.7 90 bottom
R116  130K  [R0603]  55.79,127.03 270 bottom
R117  10K  [R0603]  52.86,115.42 0 bottom
R118  0R  [R0603]  44.35,126.94 180 bottom
R119  0R  [R0603]  65.56,104.86 0 bottom
R120  0R  [R0603]  65.55,102.83 0 bottom
R121  4.7K  [R0603]  66.19,107.5 270 bottom
R122  4.7K  [R0603]  64.59,107.5 270 bottom
R123  5.1K  [R0603]  23.49,36.57 270 bottom
R124  5.1R  [R0603]  146.9,55.67 180 bottom
R125  4.7K  [R0603]  148.45,61.07 270 bottom
R126  4.7K  [R0603]  170.37,51.57 90 bottom
R127  10K  [R0603-SP]  181.29,103.12 90 bottom
R128  10K  [R0603-SP]  179.77,103.12 90 bottom
R129  10K  [R0603-SP]  175.63,103.12 90 bottom
R130  10K_NC  [R0603-SP]  174.14,103.12 90 bottom
R131  10K  [R0603-SP]  172.65,103.12 90 bottom
R132  10K  [R0603-SP]  173.39,100.13 0 bottom
R133  0R  [R0603]  135.5,32.66 270 bottom
R134  0R_NC  [R0603]  135.51,29.71 90 bottom
R135  100K  [R0603-SP]  118.39,140.42 0 bottom
R136  0R  [R0603-SP]  127,133.25 270 bottom
R137  0R  [R0603-SP]  128.42,133.25 270 bottom
R138  0R  [R0603-SP]  129.84,133.26 270 bottom
R139  100K  [R0603-SP]  74.53,143.69 180 bottom
R140  0R  [R0603]  92.05,45.06 270 bottom
R141  0R  [R0603]  63.63,126.29 180 bottom
R142  95.3K  [R0603]  50.65,74.05 270 bottom
R143  50K  [R0603-SP]  74.53,142.27 0 bottom
R144  0R  [R0603]  71,120.35 180 bottom
R145  0R  [R0603]  74.5,120.37 180 bottom
R146  10K  [R0603]  78.62,114.91 180 bottom
R147  10K_NC  [R0603]  78.62,116.44 180 bottom
R148  100R  [R0603]  36.35,49.94 0 bottom
R149  10K  [R0603]  47.6,114.7 90 bottom
R150  13K  [R0603]  49.15,74.03 90 bottom
R151  0R  [R0603]  117.48,45.14 180 bottom
R152  100R  [R0603]  90.75,76.55 90 top
R153  100R  [R0603]  89.25,76.55 90 top
R154  100R  [R0603]  84.19,76.55 90 top
R155  100R  [R0603]  82.69,76.55 90 top
R156  100R  [R0603]  85.99,76.55 90 top
R157  100R  [R0603]  87.49,76.55 90 top
R158  4.02K  [R0603]  88.15,68 90 top
R159  1.1R  [R0603-SP]  117.51,120.42 0 bottom
R160  10K  [R0603-SP]  118.1,117.16 90 bottom
R161  10K  [R0603]  147.07,127.56 0 bottom
R162  10K  [R0603]  151.52,114.1 90 bottom
R163  1.1R_NC  [R0603-SP]  117.51,121.85 0 bottom
R164  10K  [R0603]  63.77,117.3 0 bottom
R165  100K  [R0603]  124.26,123.1 180 bottom
R166  180K  [R0603]  123.35,129.55 0 bottom
R167  12K  [R0603]  124.23,133.16 270 bottom
R168  1.6K  [R0603]  70.97,128.22 270 bottom
R169  1K  [R0603]  73.84,128.27 90 bottom
R170  0R  [R0603-SP]  134.18,126.03 0 bottom
R171  0R  [R0603-SP]  134.18,124.59 0 bottom
R172  220R  [R0603]  115.67,136.85 90 bottom
R173  51K  [R0603]  111.97,138.26 270 bottom
R174  220R  [R0603]  115.63,133.28 270 bottom
R175  51K  [R0603]  111.95,132.46 90 bottom
R176  0R  [R0603]  113.11,126.42 90 bottom
R177  10K  [R0603]  142.37,114.99 270 bottom
R178  10K  [R0603]  140.09,114.99 270 bottom
R179  10K  [R0603]  74.51,139.97 0 bottom
R180  10K_NC  [R0603]  77.56,138.52 0 bottom
R181  10K_NC  [R0603]  74.55,135.67 0 bottom
R182  10K  [R0603]  77.55,135.67 0 bottom
R185  0R  [R0603]  96.02,76.61 270 top
R186  0R  [R0603]  97.47,76.58 270 top
R187  0R  [R0603]  100.85,76.56 270 top
R188  0R  [R0603]  99.32,76.56 270 top
R189  0R  [R0603]  94.17,76.56 270 top
R190  0R  [R0603]  92.65,76.56 270 top
R191  10K  [R0603]  74.5,121.8 0 bottom
R192  10K_NC  [R0603]  77.47,121.8 0 bottom
R193  10K_NC  [R0603]  74.52,124.66 0 bottom
R194  10K  [R0603]  77.47,124.67 0 bottom
R195  1K_NC  [R0603]  74.5,123.25 0 bottom
R196  0R  [R0603]  74.55,126.09 180 bottom
R197  0R  [R0603]  78.16,128.25 270 bottom
R198  0R_NC  [R0603]  76.71,128.22 270 bottom
R199  0R  [R0603]  74.55,131.22 180 bottom
R200  0R  [R0603]  70.46,132.62 180 bottom
R201  10K  [R0603]  74.55,132.67 0 bottom
R202  4.02K  [R0603]  99.65,68.03 270 top
R203  0R  [R0603]  77.66,44.19 0 bottom
R205  0R  [R0603]  111.26,63.17 90 top
R206  0R  [R0603]  109.86,63.17 90 top
R207  4.7K  [R0603]  134.13,114.29 0 bottom
R208  4.7K  [R0603]  134.13,115.74 0 bottom
R209  1K  [R0603]  160.73,67.61 0 bottom
R210  10K_NC  [R0603]  77.71,38.39 90 bottom
R211  0R  [R0603]  78.52,62.44 180 top
R212  0R  [R0603]  137.68,90.55 0 bottom
R213  0R  [R0603]  22.05,38.48 90 bottom
R214  0R  [R0603]  48.16,47.75 0 bottom
R215  0R  [R0603]  146.09,61.83 180 bottom
R216  0R  [R0603]  161.11,113.49 180 bottom
R217  0R  [R0603]  161.13,112.07 180 bottom
R219  0R  [R0603]  134.18,118.66 0 bottom
R220  0R  [R0603]  134.18,123.17 0 bottom
R221  0R  [R0603]  134.2,121.7 0 bottom
R222  0R  [R0603]  134.18,120.25 0 bottom
R223  4.7K  [R0603-SP]  111.13,27.93 90 bottom
R224  4.7K  [R0603-SP]  110.42,34.25 90 bottom
R225  0R  [R0603]  74.52,137.11 180 bottom
R226  0R_NC  [R0603]  104.52,40.39 0 bottom
R227  0R  [R0603]  70.51,131.17 180 bottom
R228  0R  [R0603]  74.55,134.2 180 bottom
R230  0R  [R0603]  74.54,138.55 180 bottom
R231  0R  [R0603]  117.43,46.56 0 bottom
R232  0R  [R0603]  118.1,114.24 90 bottom
R234  30K  [R0603]  125.63,77.14 180 bottom
R235  30K  [R0603]  124.13,72.06 0 bottom
R236  30K  [R0603]  124.13,69.52 0 bottom
R237  10K  [R0603]  132.92,56.7 90 bottom
R238  10K_NC  [R0603]  132.92,53.41 90 bottom
R239  30K  [R0603]  124.13,66.98 0 bottom
R240  30K  [R0603]  124.13,64.44 0 bottom
R241  30K  [R0603]  124.13,61.9 0 bottom
R242  30K  [R0603]  124.13,59.36 0 bottom
R243  30K  [R0603]  124.13,56.82 0 bottom
R244  30K  [R0603]  124.13,54.28 0 bottom
R245  30K  [R0603]  124.13,51.74 0 bottom
R246  30K  [R0603]  124.13,49.2 0 bottom
R247  30K  [R0603]  124.13,46.66 0 bottom
R248  30K  [R0603]  124.13,44.12 0 bottom
R249  30K  [R0603]  124.13,41.58 0 bottom
R250  30K  [R0603]  124.13,33.96 0 bottom
R251  30K  [R0603]  124.13,31.42 0 bottom
R252  30K  [R0603]  64.63,77.14 0 bottom
R253  30K  [R0603]  66.13,44.12 180 bottom
R254  30K  [R0603]  66.13,33.96 180 bottom
R255  30K  [R0603]  66.13,31.42 180 bottom
R256  30K  [R0603]  125.63,74.6 180 bottom
R257  4.7K  [R0603]  83.06,28 90 bottom
R258  0R_NC  [R0603]  100.62,34.98 270 bottom
R259  4.7K  [R0603]  81.09,28 90 bottom
R260  0R_NC  [R0603]  95.83,34.98 270 bottom
R261  30K  [R0603]  125.63,39.04 180 bottom
R262  30K  [R0603]  125.63,36.5 180 bottom
R263  30K  [R0603]  125.63,28.88 180 bottom
R264  30K  [R0603]  64.63,74.6 0 bottom
R265  30K  [R0603]  64.63,72.06 0 bottom
R266  30K  [R0603]  64.63,69.52 0 bottom
R267  30K  [R0603]  64.63,66.98 0 bottom
R268  30K  [R0603]  64.64,64.44 0 bottom
R269  30K  [R0603]  64.63,61.9 0 bottom
R270  30K  [R0603]  64.63,59.36 0 bottom
R271  30K  [R0603]  64.63,56.82 0 bottom
R272  30K  [R0603]  64.63,54.28 0 bottom
R273  10K  [R0603]  22.76,73.49 270 bottom
R274  100R  [R0603]  24.96,72.73 180 bottom
R275  30K  [R0603]  64.63,51.74 0 bottom
R276  22R  [R0603]  14.65,78.15 0 bottom
R277  30K  [R0603]  64.63,49.2 0 bottom
R278  30K  [R0603]  64.63,46.66 0 bottom
R279  30K  [R0603]  64.63,41.58 0 bottom
R280  30K  [R0603]  64.63,39.04 0 bottom
R281  30K  [R0603]  64.63,36.5 0 bottom
R282  30K  [R0603]  64.63,28.88 0 bottom
R283  10K  [R0603]  143.08,69.27 270 bottom
R284  100K  [R0603]  154.18,69.48 90 bottom
R285  30K  [R0603]  154.94,67.29 0 bottom
R286  10K  [R0603]  148.43,31.87 0 bottom
R287  1K  [R0603]  148.42,33.29 0 bottom
R288  10K  [R0603]  148.41,26.82 180 bottom
R289  0R  [R0603]  125.56,79.14 0 bottom
R290  0R  [R0603]  117.43,51.74 0 bottom
R291  0R  [R0603]  117.35,64.44 0 bottom
R292  0R  [R0603]  133.48,48 90 bottom
R293  0R  [R0603]  134.88,48 90 bottom
R294  0R  [R0603]  117.45,49.24 180 bottom
R295  0R  [R0603]  117.35,66.98 0 bottom
R296  0R  [R0603]  117.35,69.52 0 bottom
R297  0R  [R0603]  117.42,33.95 0 bottom
R298  0R  [R0603]  117.43,31.37 0 bottom
R299  2K  [R0603]  137.69,89.09 0 bottom
R302  0R  [R0603]  117.45,56.85 180 bottom
R305  0R  [R0603]  117.35,59.36 180 bottom
R307  2K  [R0603]  108.45,40.38 0 bottom
R311  0R  [R0603]  64.65,78.67 180 top
R312  0R  [R0603]  72.83,31.46 180 bottom
R313  0R  [R0603]  72.84,34.03 180 bottom
R315  0R  [R0603]  117.43,54.26 0 bottom
R317  0R  [R0603]  72.81,44.1 180 bottom
R324  0R  [R0603]  117.35,72.06 0 bottom
R328  0R  [R0603]  117.35,61.9 0 bottom
R329  0R_NC  [R0603]  59.21,73.31 180 bottom
R332  0R  [R0603]  161.14,110.64 180 bottom
R422  4.7K  [R0603]  61.91,75.76 90 bottom
R423  4.7K  [R0603]  56.56,74.09 270 bottom
R639  1K  [R0603]  39.18,47.81 180 bottom
R652  1K  [R0603]  41.37,47.01 90 bottom
R653  2K  [R0603]  44.35,47.02 90 bottom
R654  3.6K  [R0603]  42.86,47.02 90 bottom
R655  8.2K  [R0603]  45.81,47 90 bottom
SW1  switch_6pin  [SWITCH_6PIN_2P]  171.11,54.82 90 top
SW2  switch_6pin  [SWITCH_6PIN_2P]  122.75,127.82 90 top
TP1  TPTP08R  [TP08R]  90.81,79.06 0 bottom
TP2  TPTP08R  [TP08R]  89.27,79.05 0 bottom
TP3  TPTP08R  [TP08R]  84.2,79.08 0 bottom
TP4  TPTP08R  [TP08R]  82.72,79.1 0 bottom
TP5  TPTP08R  [TP08R]  86.01,79.06 0 bottom
TP6  TPTP08R  [TP08R]  87.52,79.04 0 bottom
TP7  TPTP08R  [TP08R]  92.63,79.07 0 bottom
TP8  TPTP08R  [TP08R]  94.18,79.04 90 bottom
TP9  TPTP08R  [TP08R]  99.31,79.08 0 bottom
TP10  TPTP08R  [TP08R]  100.83,79.11 0 bottom
TP11  TPTP08R  [TP08R]  97.5,79.05 0 bottom
TP12  TPTP08R  [TP08R]  96.08,79.02 0 bottom
U1  ESP32-P4NRW32  [IC_ESP32-P4NRW32]  95.13,57.89 180 top
U2  RY3430_C370755  [SOT95P280X145-5N]  149.33,39.55 180 bottom
U3  RY3430_C370755  [SOT95P280X145-5N]  80.9,38.88 0 bottom
U4  IP101GR  [QFN32_4X4]  156.28,89.07 90 bottom
U5  DHT20  [CROWTAIL-DHT20-V1.0-20211013_DHT20]  149.48,77.91 90 top
U6  LSM6DS3TR-C  [LGA-14L]  65.39,103.69 0 top
U7  HAL248  [SOT-23W]  16.64,36.75 90 top
U8  LMD4737T261  [MIC_LMD4737T261]  136.33,31.7 0 top
U9  NS4168-L  [NS4168-ESOP-8]  67.76,140.28 0 bottom
U10  NS4168-R  [NS4168-ESOP-8]  125.33,140.45 180 bottom
U11  MT9201  [COOPER_SOT23-6]  115.8,117.71 180 bottom
U12  CH340K  [ESOP-10-EP-150MIL]  170.31,25.47 270 bottom
U13  UMH3NTN  [SOP65P210X100-6N]  176.38,23.78 90 bottom
U14  WS2814A  [WS2814A]  33.54,54.69 270 bottom
U15  ME6211C18M5G-N_NC  [SOT95P282X145-5N]  63.61,120.24 90 bottom
U16  SX1308  [SOT95P280X145-6N]  123.62,126.01 270 bottom
U17  MT3540  [SOT95P280X145-5N]  146.02,69.14 0 bottom
U18  MT3608  [DBV_R-PDSO-G6]  44.84,73.33 270 bottom
U19  SGM3799_NC  [IC_SGM3799_TQFN2.6X1.8_16L]  150.25,117.91 90 bottom
U44  ETA6280S2F/RY2121  [IC_SOT23-5]  164.36,68.89 270 bottom
U101  BIS0001  [SOP16]  56.48,118.29 0 bottom
U121  BH1750  [B1750]  134.82,55.52 0 top
U123  TTP223  [SOT23-6L]  147.89,29.37 270 bottom
U$196  MSOP10  [MSOP10]  150.25,118.17 90 bottom
Y1  40MHZ  [X322540MPB4SI]  98.17,45.39 180 top
Y2  X322525MSB4SI  [SMD3225]  155.53,80.68 180 bottom
Y4  32.768K  [NORDIC_NRF_XTAL_3215_N]  108.2,50.2 90 top

## Tracks (layer width: path | path; a pad name or v marks a point on that pad's centre or on a via)
3.3V
  Bottom 0.305: J17.2 85.88,132.16 85.6,131.88
  Bottom 0.508: R199.2 77.46,131.22 P34.P$1 78.19,131.5 79.47,132.77 82.55,132.77 83.44,131.88 85.6,131.88
3V3_MIC  (via drill 0.35)
  Top 0.508: U8.6 136.02,34.54 v135.46,34.54
  Bottom 0.508: 135.51,34.54 v135.46,34.54 | R133.1 135.5,34.53 135.51,34.54 | FB1.2 C69.2 135.51,35.39 135.51,34.54
+5V_SYS_GAS  (via drill 0.35, 0.4)
  Top 0.61: SW1.2 v172.22,54.82 v172.21,54.83
  Top 0.635: v162.06,52.51 v166.63,52.51
  Bottom 0.61: C67.2 160.49,54.81 J6.2 | J6.2 159.62,53.71 J6.3 | J6.2 159.62,57.65 J6.1
  Bottom 0.635: C67.2 v162.06,52.51 | v166.63,52.51 170.19,52.51 R126.2 170.37,53.52 171.68,54.83 v172.21,54.83
AUDIO_VDD_3V3  (via drill 0.35)
  Top 0.254: v110.75,142.04 111,142.04 112.65,140.39 v116.72,140.39
  Bottom 0.254: v110.75,142.04 110.62,142.04 78.24,142.04 76.59,143.69 R139.2 75.29,143.9 74.58,144.61 70.9,144.61 69.35,143.06 69.35,134.98 67.2,132.83 Q7.3 | R135.2 117.61,140.39 v116.72,140.39
AVDD33
  Bottom 0.203: U4.31 160.85,87.17 162.33,85.69 C56.2 | 162.32,84.38 C55.2 162.32,81.4
  Bottom 0.305: C56.2 162.32,84.38 | 162.32,81.4 R59.1
BIT_P0.31_HAL  (via drill 0.3)
  Top 0.508: v19.03,37.69 U7.2
  Bottom 0.508: R123.1 23.1,37.72 R213.1 21.99,37.77 C65.1 20.49,37.69 v19.03,37.69 17.61,37.69 P21.P$1
CLK_N
  Top 0.157: U1.37 96,65.95 96.94,66.89 96.94,75.28 R186.2
CLK_P
  Top 0.157: U1.38 95.65,66.04 96.63,67.02 96.63,75.24 R185.2
COL
  Bottom 0.203: U4.4 156.32,86.27 156.32,85.26 154.96,83.9 R80.2 R79.1
  Bottom 0.254: R79.1
COM
  Bottom 2.032: J123.2 K4.2
CRS
  Bottom 0.152: U4.20 155.93,92.92 160.53,97.52 160.53,98.49 161.46,99.42 R81.1
  Bottom 0.203: R81.1 161.68,99.34 161.68,100.78 R82.2
CSI_3V3  (via drill 0.35)
  Top 0.508: v73.66,116.51 76.84,116.51 v77.86,117.53
  Bottom 0.508: R146.1 R147.1 v77.86,117.53 | R145.1 71.78,120.38 R144.2 | 73.72,116.57 v73.66,116.51
  Bottom 0.635: R145.1 73.72,120.35
  Bottom 0.762: 73.72,120.35 C81.1 C80.1 73.72,116.57
CSI_CLK_N  (via drill 0.35)
  Top 0.157: R156.2 86.59,77.91 86.59,79.97 v86.34,80.22
  Bottom 0.157: v86.34,80.22 86.59,79.97 86.59,79.29 86.36,79.06 TP5.TP 86.02,79.02 86.43,79.02 86.59,78.87 86.59,77.51 85.64,76.56 82.83,76.56 78.16,81.23 78.16,109.63 80.42,111.89 93.92,111.89 95.29,113.26 95.29,122.19 95.64,122.54 J12.8
CSI_CLK_P  (via drill 0.35)
  Top 0.157: R157.2 86.9,77.91 86.9,79.99 87.13,80.22 v87.15,80.22
  Bottom 0.157: v87.15,80.22 86.9,79.97 86.9,79.2 87.06,79.04 TP6.TP 87.06,79.04 86.9,78.88 86.9,77.33 85.8,76.23 82.7,76.23 77.85,81.08 77.85,109.76 80.29,112.2 93.79,112.2 94.98,113.39 94.98,122.19 94.64,122.54 J12.9
CSI_D0_N  (via drill 0.35)
  Top 0.157: R152.2 90.75,78.23 v90.81,78.3
  Bottom 0.157: J12.2 101.64,122.54 101.29,122.19 101.29,111.83 98.58,109.12 82.17,109.12 80.19,107.14 80.19,84.51 80.65,84.05 88.73,84.05 90.2,82.58 90.2,79.63 90.77,79.06 TP1.TP v90.81,78.3
CSI_D0_P  (via drill 0.35)
  Top 0.157: R153.2 89.25,78.27 v89.27,78.29
  Bottom 0.157: J12.3 100.64,122.54 100.98,122.19 100.98,111.95 98.45,109.43 82.04,109.43 79.88,107.27 79.88,84.36 80.5,83.74 88.6,83.74 89.9,82.45 89.9,79.58 89.34,79.02 89.3,79.02 TP2.TP v89.27,78.29
CSI_D1_N  (via drill 0.35)
  Top 0.157: R154.2 84.18,77.32 v84.18,78.22
  Bottom 0.157: J12.5 98.64,122.54 98.29,122.19 98.29,112.25 96.55,110.52 81.05,110.52 79.13,108.59 79.13,82.22 80.85,80.5 83.29,80.5 83.6,80.19 83.6,79.63 84.15,79.08 TP3.TP 84.18,79.06 v84.18,78.22
CSI_D1_P  (via drill 0.35)
  Top 0.157: R155.2 82.71,77.33 v82.71,78.27
  Bottom 0.157: J12.6 97.64,122.54 97.98,122.19 97.98,112.38 96.42,110.82 80.92,110.82 78.82,108.72 78.82,82.1 80.73,80.19 83.14,80.19 83.29,80.04 83.29,79.79 83.29,79.61 82.78,79.1 TP4.TP 82.71,79.09 v82.71,78.27
CSICLK_N
  Top 0.157: U1.45 93.2,65.12 91.82,66.51 91.82,68.89 86.58,74.13 86.58,75.2 R156.1
CSICLK_P
  Top 0.157: U1.44 93.55,65.21 92.13,66.63 92.13,69.02 86.9,74.25 86.9,75.19 R157.1
CSID0_N
  Top 0.157: U1.42 94.25,65.81 93.35,66.71 93.35,71.18 90.16,74.36 90.16,75.2 R152.1
CSID0_P
  Top 0.157: U1.43 93.9,65.72 93.04,66.58 93.04,71.05 89.83,74.26 89.83,75.2 R153.1
CSID1_N
  Top 0.157: U1.46 92.85,64.72 90.91,66.66 90.91,68.38 87.1,72.19 84.2,72.19 83.6,72.8 83.6,75.19 R154.1
CSID1_P
  Top 0.157: U1.47 92.5,64.63 90.5,66.63 90.5,68.33 86.95,71.88 84,71.88 83.29,72.6 83.29,75.19 R155.1
DA1  (via drill 0.3)
  Top 0.152: J7.8 181.11,99.67 v181.33,99.89
  Bottom 0.152: 181.33,102.32 v181.33,99.89 183.01,98.21 P49.P$1
  Bottom 0.203: 181.33,102.32 R127.1
DA2  (via drill 0.3)
  Top 0.152: J7.1 173.41,100.71 v172.73,101.39
  Bottom 0.152: 172.73,102.28 v172.73,101.39 172.48,101.15 170.82,101.15 170.18,100.51 170.18,98.1 P51.P$1
  Bottom 0.203: 172.73,102.28 R131.1
DATA0_N
  Top 0.157: U1.40 94.95,72.19 93.28,73.87 93.28,75.17 R190.2
DATA0_P
  Top 0.157: R189.2 93.59,75.21 93.59,74.06 95.3,72.34 U1.39
DATA1_N
  Top 0.157: U1.36 96.35,65.29 98.07,67.02 98.07,72.54 99.93,74.4 99.93,75.19 R188.2
DATA1_P
  Top 0.157: U1.35 96.7,65.21 98.38,66.89 98.38,72.4 100.27,74.28 100.27,75.21 R187.2
DN_N
  Bottom 0.203: J5.A7 184.26,30.49 184.53,30.76 184.53,31.24 184.28,31.49 J5.B7 178.49,31.49 R9.2 178.42,32.56 D019.2
DP_P
  Bottom 0.203: J5.A6 182,30.99 181.73,30.72 181.73,30.18 181.92,29.99 J5.B6 178.49,29.99 R8.2 178.42,28.66 D064.2
DSI_CLK_N  (via drill 0.35)
  Top 0.157: R186.1 96.9,77.92 96.9,79.61 v97.21,79.92
  Bottom 0.152: 109.73,124.24 109.88,124.08 109.88,110.88 112.63,108.13